# Altium project PCB_Control.V03.R00.PrjPcb (part 1 of 3)
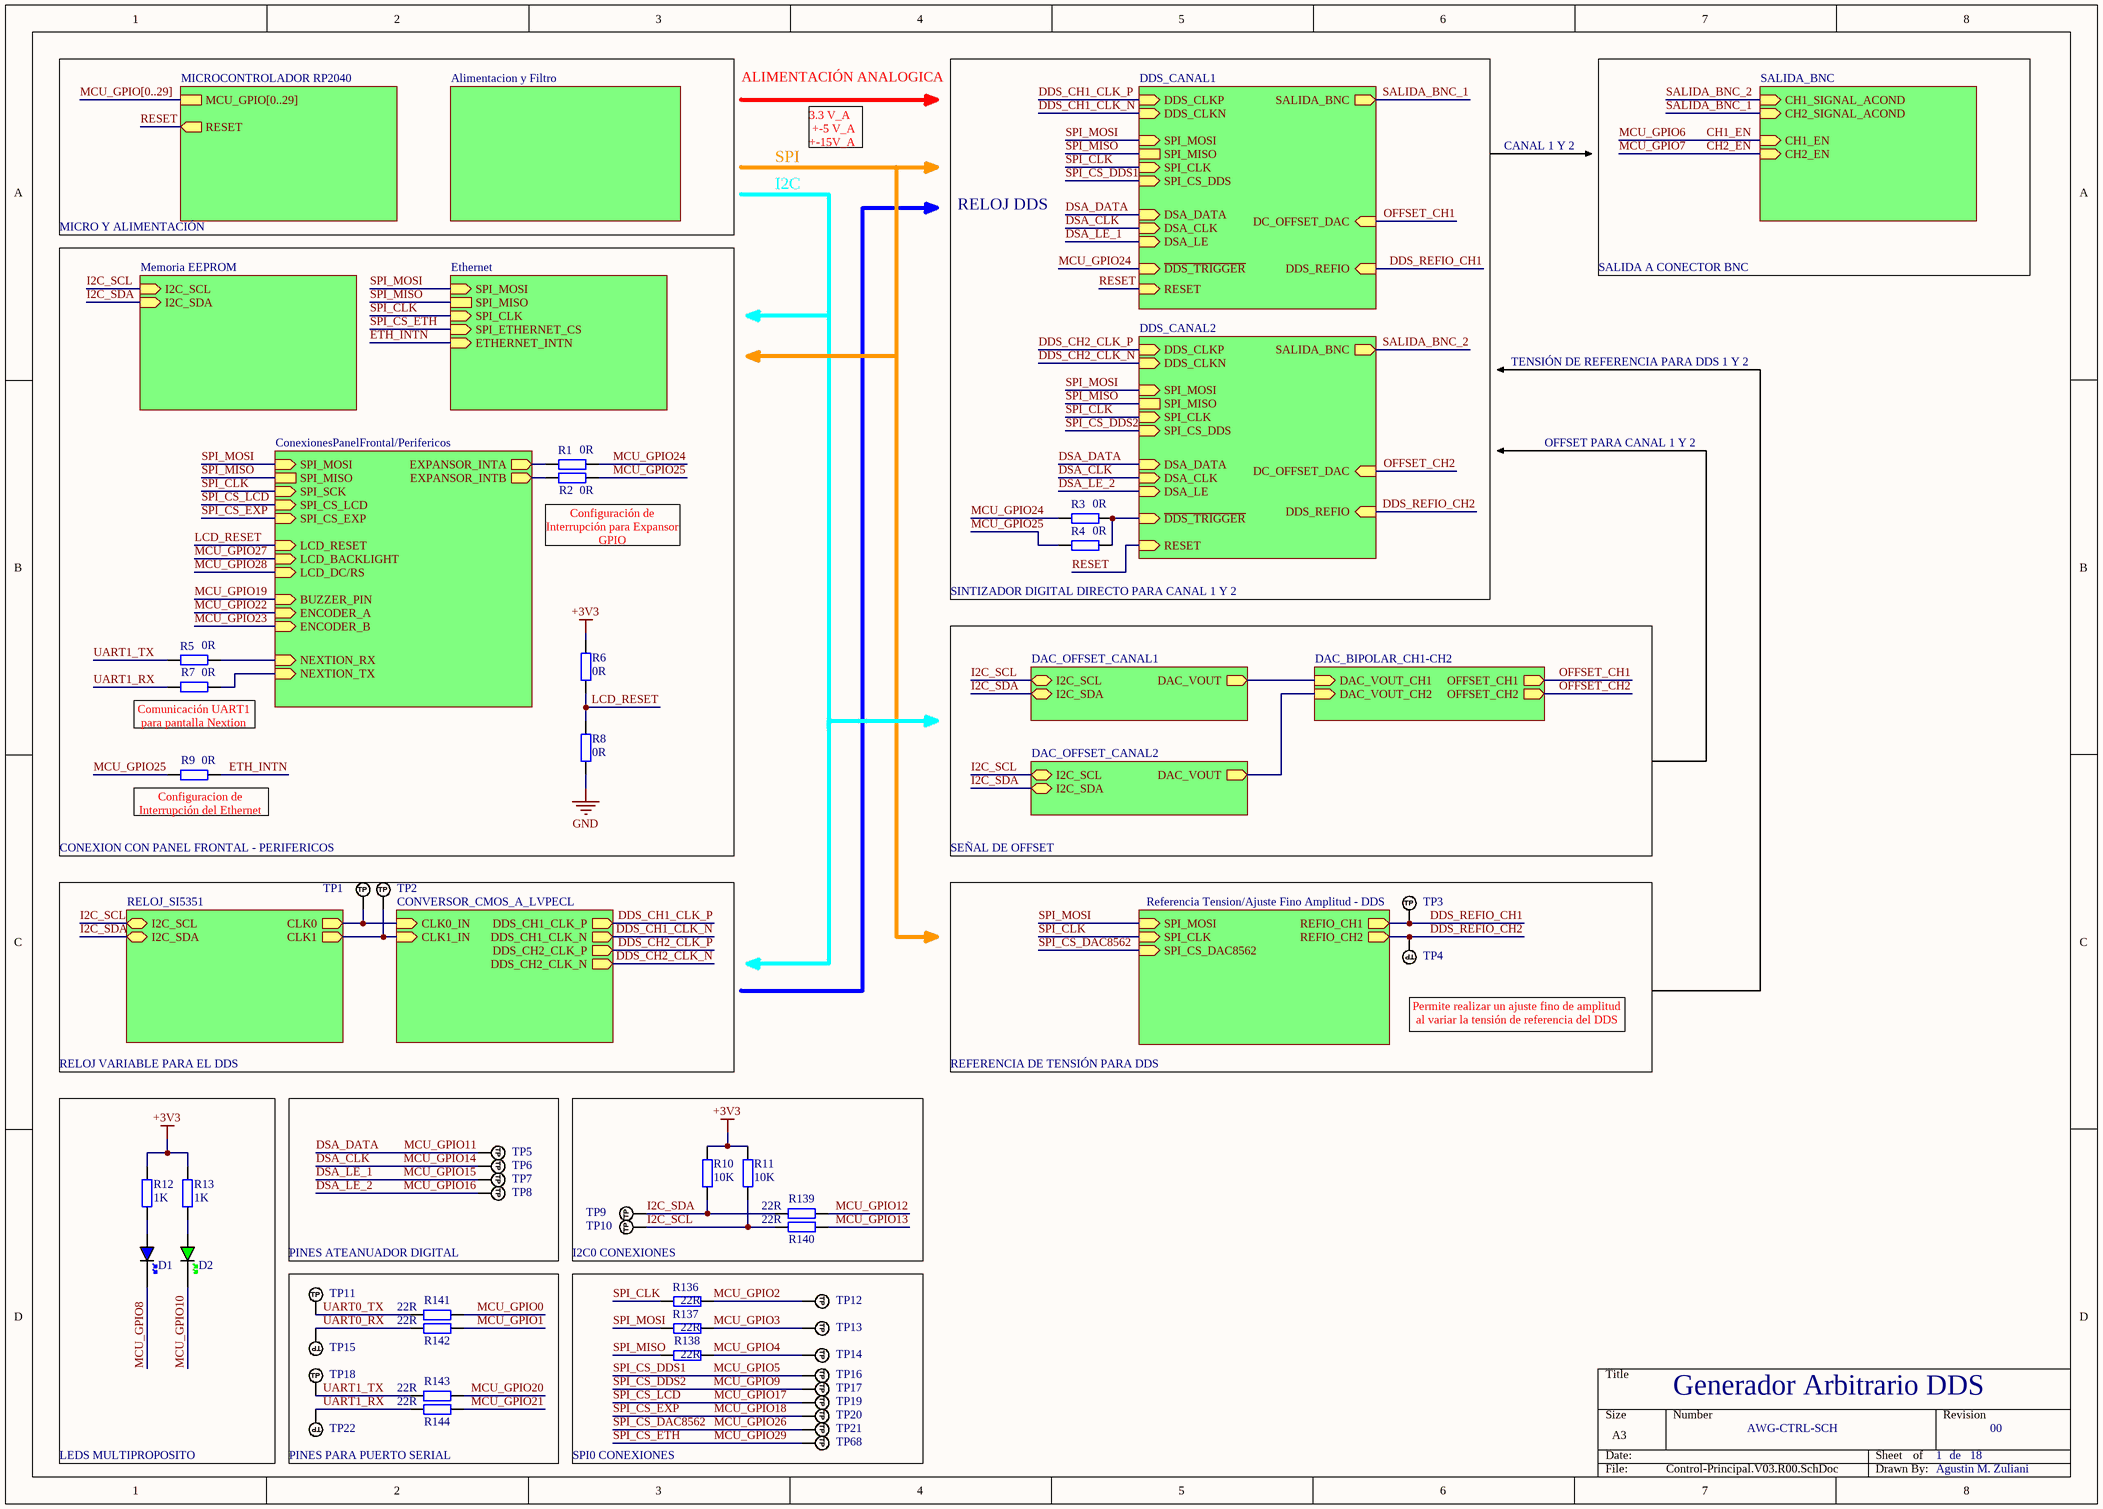
[diagram p0: Control-Principal.V03.R00.SchDoc]
DocumentNumber: AWG-CTRL-SCH; DrawnBy: Agustin M. Zuliani; Revision: 00
18 sheets, 539 parts. Net scope: hierarchical (ports join the sheet entries above them; power ports are global).
Board file: PCB_Control.V03.R00.PcbDoc
Sheets:
  Control-Principal.V03.R00.SchDoc
    MICROCONTROLADOR RP2040 = Microcontrolador.V03.R00.SchDoc
    RELOJ_SI5351 = SI5351.V03.R00.SchDoc
    DDS_CANAL1 = Canal-DDS.V03.R00.SchDoc
      DDS = Sintetizador-AD9102.V03.R00.SchDoc
      Conversor_Diff_A_Simple = DifferentialToSingleOutput.V03.R00.SchDoc
      Atenuador_Digital_Pasos = PE4312.V03.R00.SchDoc
      Offset = Offset.V03.R00.SchDoc
      Amplificador = Amplificador.V03.R00.SchDoc
    CONVERSOR_CMOS_A_LVPECL = SY55857L.V03.R00.SchDoc
    DAC_OFFSET_CANAL1 = MCP4725.V03.R00.SchDoc
    DAC_BIPOLAR_CH1-CH2 = OPA41971.V03.R00.SchDoc
    SALIDA_BNC = BNC-OUTPUT.V03.R00.SchDoc
    DDS_CANAL2 = Canal-DDS.V03.R00.SchDoc
      DDS = Sintetizador-AD9102.V03.R00.SchDoc
      Conversor_Diff_A_Simple = DifferentialToSingleOutput.V03.R00.SchDoc
      Atenuador_Digital_Pasos = PE4312.V03.R00.SchDoc
      Offset = Offset.V03.R00.SchDoc
      Amplificador = Amplificador.V03.R00.SchDoc
    DAC_OFFSET_CANAL2 = MCP4725.V03.R00.SchDoc
    Alimentacion y Filtro = Alimentacion.V03.R00.SchDoc
    ConexionesPanelFrontal/Perifericos = ConexionesPanelFrontal.V03.R00.SchDoc
    Referencia Tension/Ajuste Fino Amplitud - DDS = ReferenciaTensionDDS.V03.R00.SchDoc
    Memoria EEPROM = MemoriaEEPROM.V03.R00.SchDoc
    Ethernet = Ethernet.V03.R00.SchDoc

## Sheet Control-Principal.V03.R00.SchDoc: Generador Arbitrario DDS
size A3; SheetNumber: 1; SheetTotal: 18

### Parts
(Parts that share a designator on the sheet are numbered #1, #2 ... from top to bottom, then left to right.)
D1  BLUE  [LED_0805_BLUE]  (value not drawn)
D2  GREEN  [LED_0805_GREEN]  (value not drawn)
R1  0R  [RES_0805]
R2  0R  [RES_0805]
R3  0R  [RES_0805]
R4  0R  [RES_0805]
R5  0R  [RES_0805]
R6#1  0R  [RES_0805]
R7#1  0R  [RES_0805]
R8#1  0R  [RES_0805]
R9#1  0R  [RES_0805]
R10#1  10K  [RES_0805]
R11#1  10K  [RES_0805]
R12#1  1K  [RES_0805]
R13#1  1K  [RES_0805]
R136  22R  [RES_0805]
R137  22R  [RES_0805]
R138  22R  [RES_0805]
R139  22R  [RES_0805]
R140  22R  [RES_0805]
R141  22R  [RES_0805]
R142  22R  [RES_0805]
R143  22R  [RES_0805]
R144  22R  [RES_0805]
TP1  TP_NOBOM  [PAD_RND_1MM]  (value not drawn)  (no BOM)
TP2  TP_NOBOM  [PAD_RND_1MM]  (value not drawn)  (no BOM)
TP3  TP_NOBOM  [PAD_RND_1MM]  (value not drawn)  (no BOM)
TP4  TP_NOBOM  [PAD_RND_1MM]  (value not drawn)  (no BOM)
TP5  TP_NOBOM  [PAD_RND_1MM]  (value not drawn)  (no BOM)
TP6  TP_NOBOM  [PAD_RND_1MM]  (value not drawn)  (no BOM)
TP7  TP_NOBOM  [PAD_RND_1MM]  (value not drawn)  (no BOM)
TP8  TP_NOBOM  [PAD_RND_1MM]  (value not drawn)  (no BOM)
TP9  TP_NOBOM  [PAD_RND_1MM]  (value not drawn)  (no BOM)
TP10  TP_NOBOM  [PAD_RND_1MM]  (value not drawn)  (no BOM)
TP11  TP_NOBOM  [PAD_RND_1MM]  (value not drawn)  (no BOM)
TP12  TP_NOBOM  [PAD_RND_1MM]  (value not drawn)  (no BOM)
TP13  TP_NOBOM  [PAD_RND_1MM]  (value not drawn)  (no BOM)
TP14#1  TP_NOBOM  [PAD_RND_1MM]  (value not drawn)  (no BOM)
TP15#1  TP_NOBOM  [PAD_RND_1MM]  (value not drawn)  (no BOM)
TP16#1  TP_NOBOM  [PAD_RND_1MM]  (value not drawn)  (no BOM)
TP17#1  TP_NOBOM  [PAD_RND_1MM]  (value not drawn)  (no BOM)
TP18#1  TP_NOBOM  [PAD_RND_1MM]  (value not drawn)  (no BOM)
TP19#1  TP_NOBOM  [PAD_RND_1MM]  (value not drawn)  (no BOM)
TP20#1  TP_NOBOM  [PAD_RND_1MM]  (value not drawn)  (no BOM)
TP21#1  TP_NOBOM  [PAD_RND_1MM]  (value not drawn)  (no BOM)
TP22#1  TP_NOBOM  [PAD_RND_1MM]  (value not drawn)  (no BOM)
TP68#1  TP_NOBOM  [PAD_RND_1MM]  (value not drawn)  (no BOM)

### Blocks framed on the sheet
RELOJ DDS: R3 R4
RELOJ VARIABLE PARA EL DDS: TP1 TP2
REFERENCIA DE TENSIÓN PARA DDS: TP3 TP4
LEDS MULTIPROPOSITO: D1 D2 R12#1 R13#1
PINES ATEANUADOR DIGITAL: TP5-TP8
I2C0 CONEXIONES: R10#1 R11#1 R139 R140 TP9 TP10
PINES PARA PUERTO SERIAL: R141-R144 TP11 TP15#1 TP18#1 TP22#1
SPI0 CONEXIONES: R136-R138 TP12 TP13 TP14#1 TP16#1 TP17#1 TP19#1 TP20#1 TP21#1 TP68#1

### Sub-sheets
Alimentacion y Filtro = Alimentacion.V03.R00.SchDoc: no entries
ConexionesPanelFrontal/Perifericos = ConexionesPanelFrontal.V03.R00.SchDoc: SPI_MOSI (in), SPI_CS_LCD (in), SPI_SCK (in), LCD_DC/RS (in), LCD_RESET (in), LCD_BACKLIGHT (in), EXPANSOR_INTA (out), EXPANSOR_INTB (out), NEXTION_TX (in), NEXTION_RX (in), SPI_CS_EXP (in), BUZZER_PIN (in), ENCODER_A (in), ENCODER_B (in), SPI_MISO
CONVERSOR_CMOS_A_LVPECL = SY55857L.V03.R00.SchDoc: DDS_CH1_CLK_N (out), DDS_CH1_CLK_P (out), DDS_CH2_CLK_P (out), DDS_CH2_CLK_N (out), CLK0_IN (in), CLK1_IN (in)
DAC_BIPOLAR_CH1-CH2 = OPA41971.V03.R00.SchDoc: OFFSET_CH1 (out), DAC_VOUT_CH1 (in), DAC_VOUT_CH2 (in), OFFSET_CH2 (out)
DAC_OFFSET_CANAL1 = MCP4725.V03.R00.SchDoc: DAC_VOUT (out), I2C_SCL (bidir), I2C_SDA (bidir)
DAC_OFFSET_CANAL2 = MCP4725.V03.R00.SchDoc: DAC_VOUT (out), I2C_SCL (bidir), I2C_SDA (bidir)
DDS_CANAL1 = Canal-DDS.V03.R00.SchDoc: DDS_CLKP (in), DDS_CLKN (in), SPI_MOSI (in), SPI_MISO, SPI_CLK (in), SPI_CS_DDS (in), DSA_DATA (in), DSA_CLK (in), DSA_LE (in), DC_OFFSET_DAC (in), SALIDA_BNC (out), ~{DDS_TRIGGER} (in), DDS_REFIO (in), RESET (in)
DDS_CANAL2 = Canal-DDS.V03.R00.SchDoc: DDS_CLKP (in), DDS_CLKN (in), SPI_MOSI (in), SPI_MISO, SPI_CLK (in), SPI_CS_DDS (in), DSA_DATA (in), DSA_CLK (in), DSA_LE (in), DC_OFFSET_DAC (in), SALIDA_BNC (out), ~{DDS_TRIGGER} (in), DDS_REFIO (in), RESET (in)
Ethernet = Ethernet.V03.R00.SchDoc: SPI_MOSI (in), SPI_MISO, SPI_CLK (in), SPI_ETHERNET_CS (in), ETHERNET_INTN (in)
Memoria EEPROM = MemoriaEEPROM.V03.R00.SchDoc: I2C_SCL (in), I2C_SDA (in)
MICROCONTROLADOR RP2040 = Microcontrolador.V03.R00.SchDoc: MCU_GPIO[0..29], RESET (out)
Referencia Tension/Ajuste Fino Amplitud - DDS = ReferenciaTensionDDS.V03.R00.SchDoc: REFIO_CH1 (out), REFIO_CH2 (out), SPI_MOSI (in), SPI_CLK (in), SPI_CS_DAC8562 (in)
RELOJ_SI5351 = SI5351.V03.R00.SchDoc: I2C_SCL (bidir), I2C_SDA (bidir), CLK0 (out), CLK1 (out)
SALIDA_BNC = BNC-OUTPUT.V03.R00.SchDoc: CH1_EN (in), CH1_SIGNAL_ACOND (in), CH2_EN (in), CH2_SIGNAL_ACOND (in)

### Nets
+3V3: R6#1.1 R10#1.2 R11#1.2 R12#1.2 R13#1.2
GND: R8#1.1
DDS_CH1_CLK_N: sheet DDS_CANAL1/DDS_CLKN, sheet CONVERSOR_CMOS_A_LVPECL/DDS_CH1_CLK_N  [project net AD9102_CLK_N]
DDS_CH1_CLK_P: sheet DDS_CANAL1/DDS_CLKP, sheet CONVERSOR_CMOS_A_LVPECL/DDS_CH1_CLK_P  [project net AD9102_CLK_P]
DDS_CH2_CLK_N: sheet CONVERSOR_CMOS_A_LVPECL/DDS_CH2_CLK_N, sheet DDS_CANAL2/DDS_CLKN  [project net AD9102_CLK_N]
DDS_CH2_CLK_P: sheet CONVERSOR_CMOS_A_LVPECL/DDS_CH2_CLK_P, sheet DDS_CANAL2/DDS_CLKP  [project net AD9102_CLK_P]
DDS_REFIO_CH1: TP3.1(TP) ; sheet DDS_CANAL1/DDS_REFIO, sheet Referencia Tension/Ajuste Fino Amplitud - DDS/REFIO_CH1
DDS_REFIO_CH2: TP4.1(TP) ; sheet DDS_CANAL2/DDS_REFIO, sheet Referencia Tension/Ajuste Fino Amplitud - DDS/REFIO_CH2
DSA_CLK: TP6.1(TP) ; sheet DDS_CANAL1/DSA_CLK, sheet DDS_CANAL2/DSA_CLK  [also labelled MCU_GPIO14]
DSA_DATA: TP5.1(TP) ; sheet DDS_CANAL1/DSA_DATA, sheet DDS_CANAL2/DSA_DATA  [also labelled MCU_GPIO11]
DSA_LE_1: TP7.1(TP) ; sheet DDS_CANAL1/DSA_LE  [also labelled MCU_GPIO15]
DSA_LE_2: TP8.1(TP) ; sheet DDS_CANAL2/DSA_LE  [also labelled MCU_GPIO16]
ETH_INTN: R9#1.2 ; sheet Ethernet/ETHERNET_INTN
I2C_SCL: R11#1.1 R140.1 TP10.1(TP) ; sheet RELOJ_SI5351/I2C_SCL, sheet DAC_OFFSET_CANAL1/I2C_SCL, sheet DAC_OFFSET_CANAL2/I2C_SCL, sheet Memoria EEPROM/I2C_SCL
I2C_SDA: R10#1.1 R139.1 TP9.1(TP) ; sheet RELOJ_SI5351/I2C_SDA, sheet DAC_OFFSET_CANAL1/I2C_SDA, sheet DAC_OFFSET_CANAL2/I2C_SDA, sheet Memoria EEPROM/I2C_SDA
INTA: R1.1 ; sheet ConexionesPanelFrontal/Perifericos/EXPANSOR_INTA
INTB: R2.1 ; sheet ConexionesPanelFrontal/Perifericos/EXPANSOR_INTB
LCD_RESET: R6#1.2 R8#1.2 ; sheet ConexionesPanelFrontal/Perifericos/LCD_RESET
MCP4725_VOUT: sheet DAC_OFFSET_CANAL1/DAC_VOUT, sheet DAC_BIPOLAR_CH1-CH2/DAC_VOUT_CH1
MCP4725_VOUT: sheet DAC_BIPOLAR_CH1-CH2/DAC_VOUT_CH2, sheet DAC_OFFSET_CANAL2/DAC_VOUT  [a separate net that carries the same name]
MCU_GPIO0: R141.2
MCU_GPIO1: R142.2
MCU_GPIO2: R136.2 TP12.1(TP)
MCU_GPIO3: R137.2 TP13.1(TP)
MCU_GPIO4: R138.2 TP14#1.1(TP)
MCU_GPIO5: TP16#1.1(TP) ; sheet DDS_CANAL1/SPI_CS_DDS  [also labelled SPI_CS_DDS1]
MCU_GPIO8: D1.K
MCU_GPIO9: TP17#1.1(TP) ; sheet DDS_CANAL2/SPI_CS_DDS  [also labelled SPI_CS_DDS2]
MCU_GPIO10: D2.K
MCU_GPIO12: R139.2
MCU_GPIO13: R140.2
MCU_GPIO17: TP19#1.1(TP) ; sheet ConexionesPanelFrontal/Perifericos/SPI_CS_LCD  [also labelled SPI_CS_LCD]
MCU_GPIO18: TP20#1.1(TP) ; sheet ConexionesPanelFrontal/Perifericos/SPI_CS_EXP  [also labelled SPI_CS_EXP]
MCU_GPIO20: R143.2
MCU_GPIO21: R144.2
MCU_GPIO24: R1.2 R3.1 ; sheet DDS_CANAL1/~{DDS_TRIGGER}
MCU_GPIO25: R2.2 R4.1 R9#1.1
MCU_GPIO26: TP21#1.1(TP) ; sheet Referencia Tension/Ajuste Fino Amplitud - DDS/SPI_CS_DAC8562  [also labelled SPI_CS_DAC8562]
MCU_GPIO29: TP68#1.1(TP) ; sheet Ethernet/SPI_ETHERNET_CS  [also labelled SPI_CS_ETH]
NEXTION_RX: R5.2 ; sheet ConexionesPanelFrontal/Perifericos/NEXTION_RX
NEXTION_TX: R7#1.2 ; sheet ConexionesPanelFrontal/Perifericos/NEXTION_TX
OFFSET_CH1: sheet DDS_CANAL1/DC_OFFSET_DAC, sheet DAC_BIPOLAR_CH1-CH2/OFFSET_CH1  [project net DAC_DC_VIN]
OFFSET_CH2: sheet DAC_BIPOLAR_CH1-CH2/OFFSET_CH2, sheet DDS_CANAL2/DC_OFFSET_DAC  [project net DAC_DC_VIN]
RESET: sheet MICROCONTROLADOR RP2040/RESET, sheet DDS_CANAL1/RESET, sheet DDS_CANAL2/RESET
SALIDA_BNC_1: sheet DDS_CANAL1/SALIDA_BNC, sheet SALIDA_BNC/CH2_SIGNAL_ACOND  [project net AMPL_VOUT]
SALIDA_BNC_2: sheet SALIDA_BNC/CH1_SIGNAL_ACOND, sheet DDS_CANAL2/SALIDA_BNC  [project net AMPL_VOUT]
SI5351_CLK0: TP1.1(TP) ; sheet RELOJ_SI5351/CLK0, sheet CONVERSOR_CMOS_A_LVPECL/CLK0_IN
SI5351_CLK1: TP2.1(TP) ; sheet RELOJ_SI5351/CLK1, sheet CONVERSOR_CMOS_A_LVPECL/CLK1_IN
SPI_CLK: R136.1 ; sheet DDS_CANAL1/SPI_CLK, sheet DDS_CANAL2/SPI_CLK, sheet ConexionesPanelFrontal/Perifericos/SPI_SCK, sheet Referencia Tension/Ajuste Fino Amplitud - DDS/SPI_CLK, sheet Ethernet/SPI_CLK
SPI_MISO: R138.1 ; sheet DDS_CANAL1/SPI_MISO, sheet DDS_CANAL2/SPI_MISO, sheet ConexionesPanelFrontal/Perifericos/SPI_MISO, sheet Ethernet/SPI_MISO
SPI_MOSI: R137.1 ; sheet DDS_CANAL1/SPI_MOSI, sheet DDS_CANAL2/SPI_MOSI, sheet ConexionesPanelFrontal/Perifericos/SPI_MOSI, sheet Referencia Tension/Ajuste Fino Amplitud - DDS/SPI_MOSI, sheet Ethernet/SPI_MOSI
UART0_RX: R142.1 TP15#1.1(TP)
UART0_TX: R141.1 TP11.1(TP)
UART1_RX: R7#1.1 R144.1 TP22#1.1(TP)
UART1_TX: R5.1 R143.1 TP18#1.1(TP)
NetB17_32: R3.2 R4.2 ; sheet DDS_CANAL2/~{DDS_TRIGGER}
NetD1_A: D1.A R12#1.1
NetD2_A: D2.A R13#1.1

### Buses and harness runs
bus MCU_GPIO[0..29] = sheet MICROCONTROLADOR RP2040/MCU_GPIO[0..29]

### Notes on the sheet
- ALIMENTACIÓN ANALOGICA
- SPI
- 3.3 V_A
  +-5 V_A
  +-15V_A
- CANAL 1 Y 2
- MICRO Y ALIMENTACIÓN
- I2C
- SALIDA A CONECTOR BNC
- TENSIÓN DE REFERENCIA PARA DDS 1 Y 2
- OFFSET PARA CANAL 1 Y 2
- Configuración de Interrupción para Expansor GPIO
- (near R4) SINTIZADOR DIGITAL DIRECTO PARA CANAL 1 Y 2
- (near R7#1) Comunicación UART1 para pantalla Nextion
- CONEXION CON PANEL FRONTAL - PERIFERICOS
- (near R9#1) Configuracion de Interrupción del Ethernet
- SEÑAL DE OFFSET
- (near TP4) Permite realizar un ajuste fino de amplitud al variar la tensión de referencia del DDS
- de

### Library data of the parts
D1 = LED_0805_BLUE: LED 0805 BLUE SMD; Manufacturer: *; Manufacturer Part Number: *; Distributor Link: *; LCSC: *
D2 = LED_0805_GREEN: LED 0805 GREEN SMD; Manufacturer: *; Manufacturer Part Number: *; Distributor Link: *; LCSC: *
R1-R5 R6#1 R7#1 R8#1 R9#1 R10#1 R11#1 R12#1 R13#1 R136-R144 = RES_0805: Resistor SMD 0805; Manufacturer: *; Manufacturer Part Number: *; Distributor Link: *; LCSC: *
TP1-TP13 TP14#1 TP15#1 TP16#1 TP17#1 TP18#1 TP19#1 TP20#1 TP21#1 TP22#1 TP68#1 = TEST_POINT_RND_1MM: Test Point Round 1mm (NO BOM)

## Sheet Microcontrolador.V03.R00.SchDoc: Microcontrolador RP2040
size A3; SheetNumber: 2; SheetTotal: 18
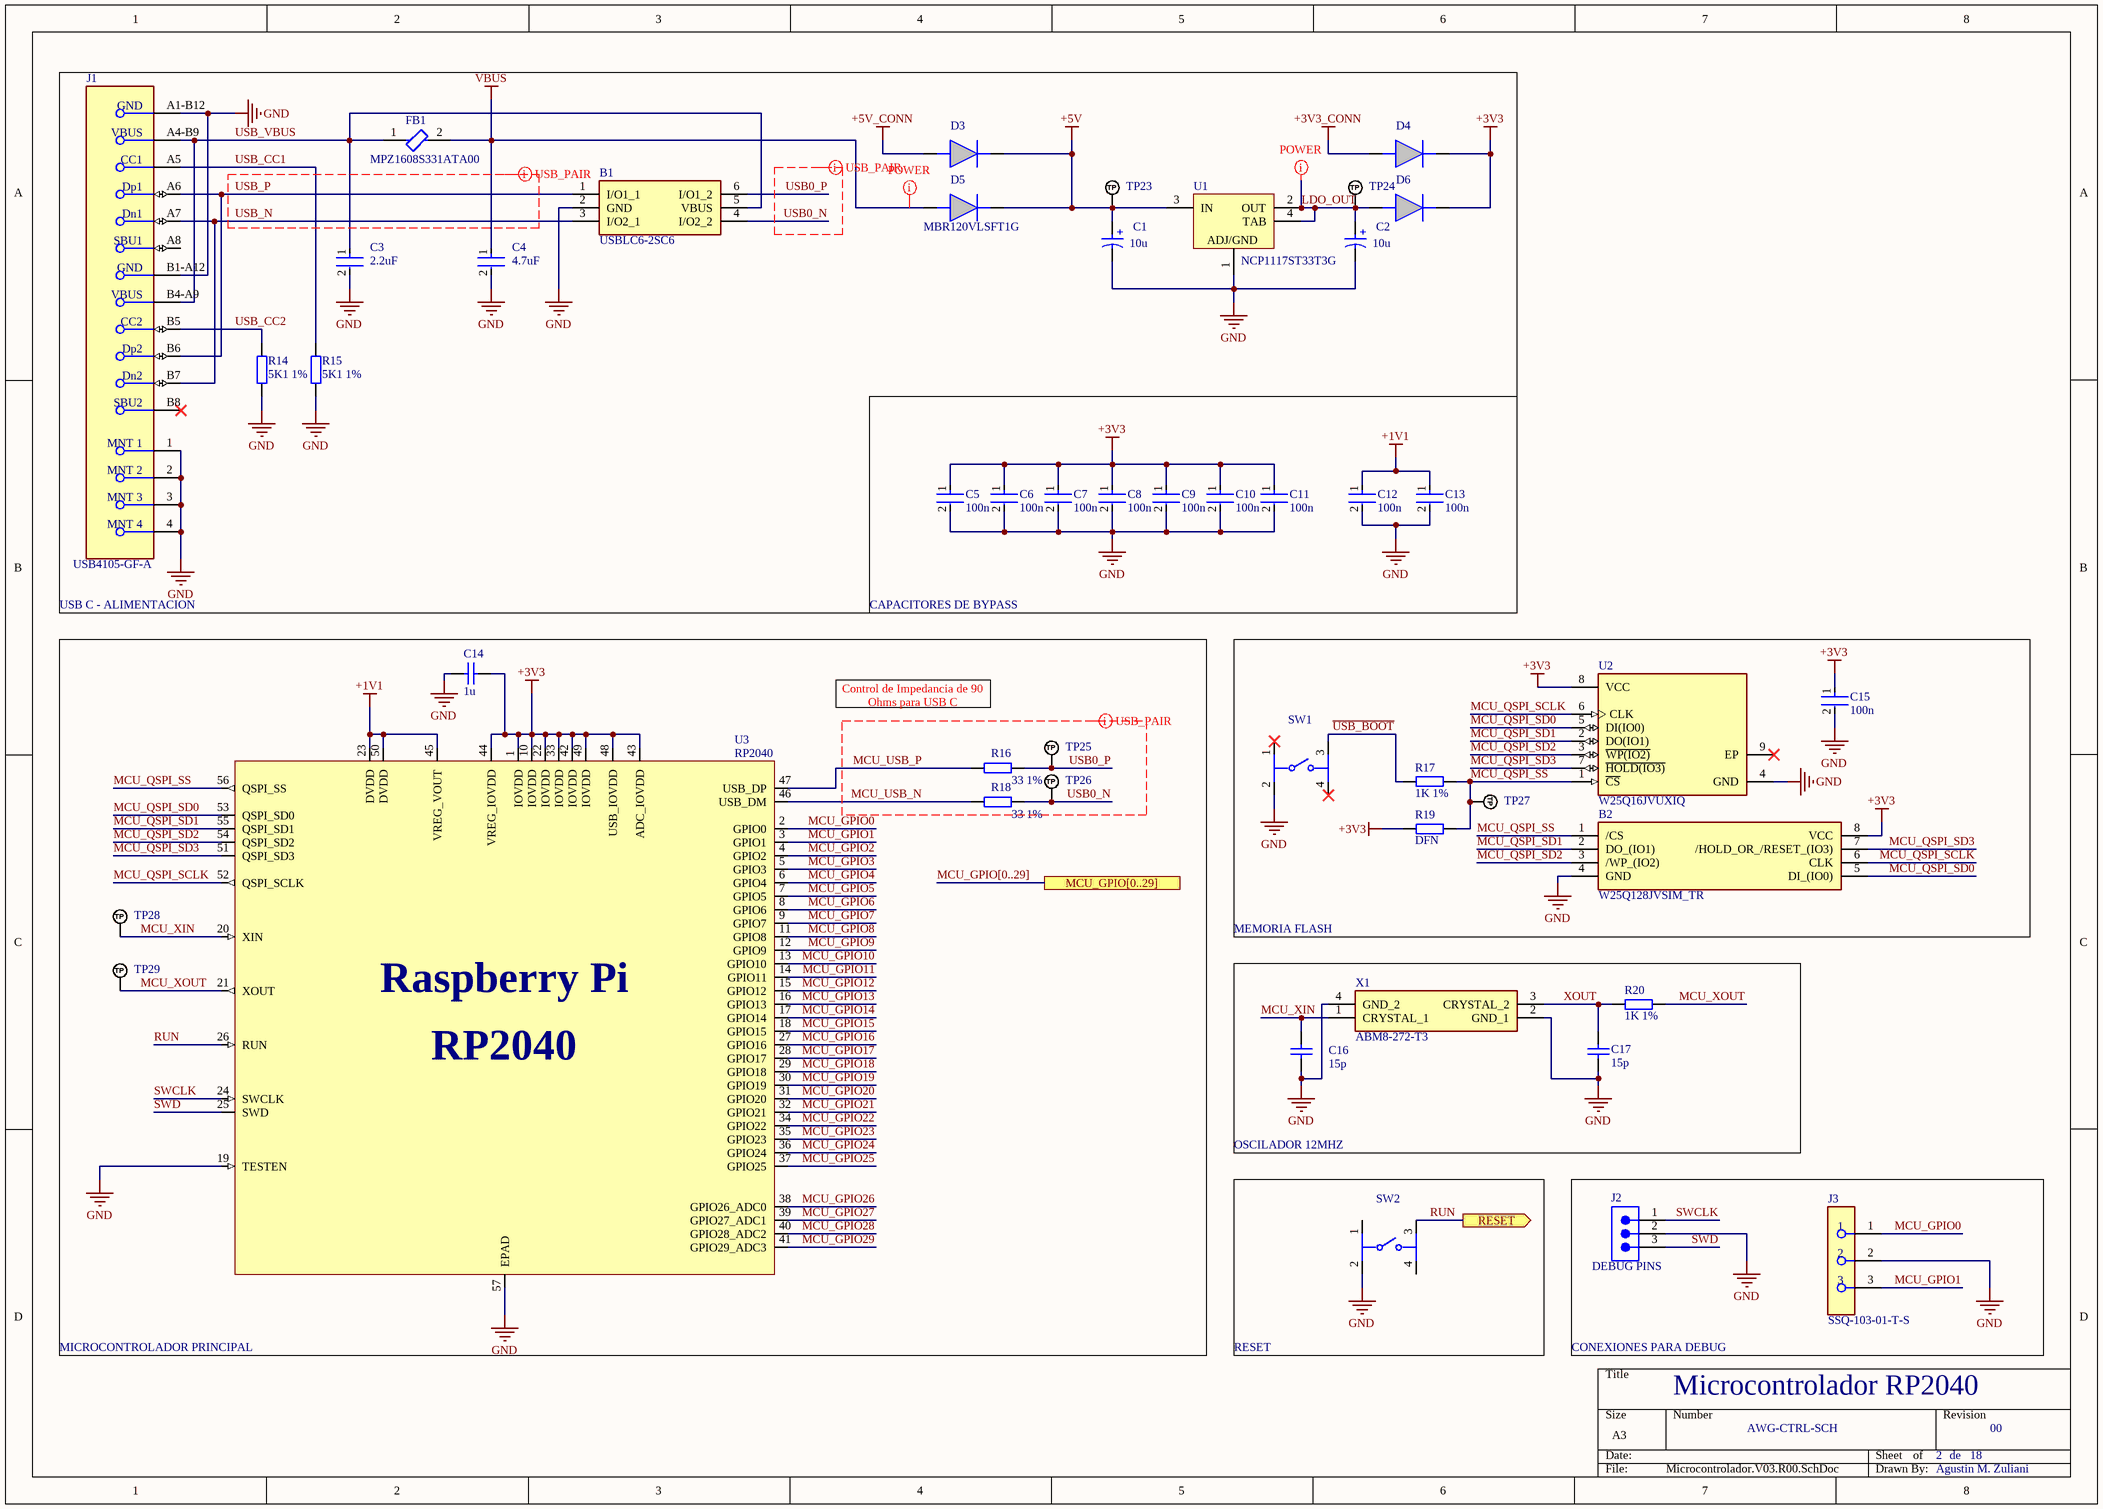
[diagram p1: Microcontrolador.V03.R00.SchDoc]

### Parts
(Parts that share a designator on the sheet are numbered #1, #2 ... from top to bottom, then left to right.)
B1  USBLC6-2SC6  [SOT95P280X145-6N]
B2#1  W25Q128JVSIM_TR  [SOIC127P790X216-8N]
C1  10u  [WCAP-ASLI_D6.3H7.7]
C2  10u  [WCAP-ASLI_D6.3H7.7]
C3  2.2uF  [FP-CC0603-DA-MFG]
C4  4.7uF  [FP-GRM21B-0_15-IPC_A]
C5  100n  [FP-CC0805-EB-MFG]
C6  100n  [FP-CC0805-EB-MFG]
C7  100n  [FP-CC0805-EB-MFG]
C8  100n  [FP-CC0805-EB-MFG]
C9  100n  [FP-CC0805-EB-MFG]
C10  100n  [FP-CC0805-EB-MFG]
C11  100n  [FP-CC0805-EB-MFG]
C12  100n  [FP-CC0805-EB-MFG]
C13  100n  [FP-CC0805-EB-MFG]
C14  1u  [CAPC2013X140X50NL20T25]
C15  100n  [FP-CC0805-EB-MFG]
C16  15p  [CAPC2013X94X50NL20T25]
C17  15p  [CAPC2013X94X50NL20T25]
D3  MBR120VLSFT1G  [SODFL3616X98N]  (value not drawn)
D4  MBR120VLSFT1G  [SODFL3616X98N]  (value not drawn)
D5  MBR120VLSFT1G  [SODFL3616X98N]
D6  MBR120VLSFT1G  [SODFL3616X98N]  (value not drawn)
FB1  MPZ1608S331ATA00  [FP-MPZ1608-0_8-IPC_C]
J1  USB4105-GF-A  [FP-USB4105-GF-A-MFG]
J2  DEBUG PINS  [SMTC-MTSW-103-08-X-S-229-RA]
J3  SSQ-103-01-T-S  [FP-SSQ-103-01-T-S-MFG]
R14#1  5K1 1%  [RES_0805]
R15#1  5K1 1%  [RES_0805]
R16#1  33 1%  [RES_0805]
R17#1  1K 1%  [RES_0805]
R18  33 1%  [RES_0805]
R19  DFN  [RES_0805]
R20  1K 1%  [RES_0805]
SW1  BOOT  [FP-2-1977223-2-MFG]  (value not drawn)
SW2  RESET  [FP-2-1977223-2-MFG]  (value not drawn)
TP23#1  TP_NOBOM  [PAD_RND_1MM]  (value not drawn)  (no BOM)
TP24  TP_NOBOM  [PAD_RND_1MM]  (value not drawn)  (no BOM)
TP25  TP_NOBOM  [PAD_RND_1MM]  (value not drawn)  (no BOM)
TP26  TP_NOBOM  [PAD_RND_1MM]  (value not drawn)  (no BOM)
TP27  TP_NOBOM  [PAD_RND_1MM]  (value not drawn)  (no BOM)
TP28  TP_NOBOM  [PAD_RND_1MM]  (value not drawn)  (no BOM)
TP29  TP_NOBOM  [PAD_RND_1MM]  (value not drawn)  (no BOM)
U1#1  NCP1117ST33T3G  [ONSC-SOT-223-4-318H-01_A_V]
U2#1  W25Q16JVUXIQ  [FP-UX-MFG]
U3#1  RP2040  [QFN-56-EP]
X1  ABM8-272-T3  [ABM8272T3]

### Blocks framed on the sheet
USB C - ALIMENTACION: B1 C1-C4 D3-D6 FB1 J1 R14#1 R15#1 TP23#1 TP24 U1#1
CAPACITORES DE BYPASS: C5-C13
MICROCONTROLADOR PRINCIPAL: C14 R16#1 R18 TP25 TP26 TP28 TP29 U3#1
MEMORIA FLASH: B2#1 C15 R17#1 R19 SW1 TP27 U2#1
OSCILADOR 12MHZ: C16 C17 R20 X1
RESET: SW2
CONEXIONES PARA DEBUG: J2 J3

### Ports
MCU_GPIO[0..29], RESET (out)

### Nets
+1V1: C12.1 C13.1 U3#1.23(DVDD) U3#1.45(VREG_VOUT) U3#1.50(DVDD)
+3V3: B2#1.8(VCC) C5.1 C6.1 C7.1 C8.1 C9.1 C10.1 C11.1 C14.2 C15.1 D4.1(K) D6.1(K) R19.1 U2#1.8(VCC) U3#1.1(IOVDD) U3#1.10(IOVDD) U3#1.22(IOVDD) U3#1.33(IOVDD) U3#1.42(IOVDD) U3#1.43(ADC_IOVDD) U3#1.44(VREG_IOVDD) U3#1.48(USB_IOVDD) U3#1.49(IOVDD)
+3V3_CONN: D4.2(A)
+5V: C1.1(P) D3.1(K) D5.1(K) TP23#1.1(TP) U1#1.3(IN)
+5V_CONN: D3.2(A)
GND: B1.2(GND) B2#1.4(GND) C1.2(N) C2.2(N) C3.2 C4.2 C5.2 C6.2 C7.2 C8.2 C9.2 C10.2 C11.2 C12.2 C13.2 C14.1 C15.2 C16.1 C17.1 J1.1(MNT_1) J1.2(MNT_2) J1.3(MNT_3) J1.4(MNT_4) J1.A1-B12(GND) J1.B1-A12(GND) J2.2 J3.2 R14#1.1 R15#1.1 SW1.2 SW2.2 U1#1.1(ADJ/GND) U2#1.4(GND) U3#1.19(TESTEN) U3#1.57(EPAD) X1.2(GND_1) X1.4(GND_2)
VBUS: C4.1 D5.2(A) FB1.2
~{USB_BOOT}: R17#1.1 SW1.3
LDO_OUT: C2.1(P) D6.2(A) TP24.1(TP) U1#1.2(OUT) U1#1.4(TAB)
MCU_GPIO0: J3.1 U3#1.2(GPIO0)
MCU_GPIO1: J3.3 U3#1.3(GPIO1)
MCU_GPIO2: U3#1.4(GPIO2)
MCU_GPIO3: U3#1.5(GPIO3)
MCU_GPIO4: U3#1.6(GPIO4)
MCU_GPIO5: U3#1.7(GPIO5)
MCU_GPIO6: U3#1.8(GPIO6)  [project net CH1_EN]
MCU_GPIO7: U3#1.9(GPIO7)  [project net CH2_EN]
MCU_GPIO8: U3#1.11(GPIO8)
MCU_GPIO9: U3#1.12(GPIO9)
MCU_GPIO10: U3#1.13(GPIO10)
MCU_GPIO11: U3#1.14(GPIO11)  [project net DSA_DATA]
MCU_GPIO12: U3#1.15(GPIO12)
MCU_GPIO13: U3#1.16(GPIO13)
MCU_GPIO14: U3#1.17(GPIO14)  [project net DSA_CLK]
MCU_GPIO15: U3#1.18(GPIO15)  [project net DSA_LE_1]
MCU_GPIO16: U3#1.27(GPIO16)  [project net DSA_LE_2]
MCU_GPIO17: U3#1.28(GPIO17)
MCU_GPIO18: U3#1.29(GPIO18)
MCU_GPIO19: U3#1.30(GPIO19)  [project net BUZZER]
MCU_GPIO20: U3#1.31(GPIO20)
MCU_GPIO21: U3#1.32(GPIO21)
MCU_GPIO22: U3#1.34(GPIO22)  [project net ENCODER_A]
MCU_GPIO23: U3#1.35(GPIO23)  [project net ENCODER_B]
MCU_GPIO24: U3#1.36(GPIO24)
MCU_GPIO25: U3#1.37(GPIO25)
MCU_GPIO26: U3#1.38(GPIO26_ADC0)
MCU_GPIO27: U3#1.39(GPIO27_ADC1)
MCU_GPIO28: U3#1.40(GPIO28_ADC2)
MCU_GPIO29: U3#1.41(GPIO29_ADC3)
MCU_QSPI_SCLK: B2#1.6(CLK) U2#1.6(CLK) U3#1.52(QSPI_SCLK)
MCU_QSPI_SD0: B2#1.5(DI_(IO0)) U2#1.5(DI(IO0)) U3#1.53(QSPI_SD0)
MCU_QSPI_SD1: B2#1.2(DO_(IO1)) U2#1.2(DO(IO1)) U3#1.55(QSPI_SD1)
MCU_QSPI_SD2: B2#1.3(/WP_(IO2)) U2#1.3(~{WP(IO2)}) U3#1.54(QSPI_SD2)
MCU_QSPI_SD3: B2#1.7(/HOLD_OR_/RESET_(IO3)) U2#1.7(~{HOLD(IO3)}) U3#1.51(QSPI_SD3)
MCU_QSPI_SS: B2#1.1(/CS) R17#1.2 R19.2 TP27.1(TP) U2#1.1(~{CS}) U3#1.56(QSPI_SS)
MCU_USB_N: R18.1 U3#1.46(USB_DM)
MCU_USB_P: R16#1.1 U3#1.47(USB_DP)
MCU_XIN: C16.2 TP28.1(TP) U3#1.20(XIN) X1.1(CRYSTAL_1)
MCU_XOUT: R20.2 TP29.1(TP) U3#1.21(XOUT)
RUN: SW2.3 U3#1.26(RUN) ; port RESET  [project net RESET]
SWCLK: J2.1 U3#1.24(SWCLK)
SWD: J2.3 U3#1.25(SWD)
USB0_N: B1.4(I/O2_2) R18.2 TP26.1(TP)
USB0_P: B1.6(I/O1_2) R16#1.2 TP25.1(TP)
USB_CC1: J1.A5(CC1) R15#1.2
USB_CC2: J1.B5(CC2) R14#1.2
USB_N: B1.3(I/O2_1) J1.A7(Dn1) J1.B7(Dn2)
USB_P: B1.1(I/O1_1) J1.A6(Dp1) J1.B6(Dp2)
USB_VBUS: B1.5(VBUS) C3.1 FB1.1 J1.A4-B9(VBUS) J1.B4-A9(VBUS)
XOUT: C17.2 R20.1 X1.3(CRYSTAL_2)

Not connected (* = marked no-connect by the designer): J1 A8(SBU1) B8(SBU2)*; SW1 1* 4*; SW2 1 4; U2#1 9(EP)*

### Buses and harness runs
bus MCU_GPIO[0..29] = port MCU_GPIO[0..29]

### Layout directives
differential pair; differential pair class USB; rule Differential Pairs Routing [Pref Gap = 0.127mm    Min Gap  = 0.127mm    Max Gap  = 0.2mmPref Width = 0.15mm    Min Width  = 0.116mm    Max Width  = 0.16mm]; rule Matched Net Lengths [Tolerance = 0.25mm]; net class USB: MCU_USB_N, MCU_USB_P, USB0_N, USB0_P, USB_N, USB_P
net class POWER; rule Width Constraint [Pref Width = 0.5mm    Min Width = 0.2mm    Max Width = 1mm]; rule Routing Via Style [Pref Size = 1.27mm    Pref Hole Size = 0.711mm]; rule Clearance Constraint [Clearance = 0.2mm]; rule Polygon Connect Style [Style - Direct Connect]: LDO_OUT, VBUS

### Notes on the sheet
- Control de Impedancia de 90 Ohms para USB C
- de
- (in symbol CMP-03913-89507488-2) +

### Library data of the parts
B1 = USBLC6-2SC6: TVS Diode Array Uni-Directional USBLC6-2SC6 17V, SOT-23 6-Pin; Manufacturer_Name: STMicroelectronics; Geometry.Height: 1.45mm; Mouser Part Number: 511-USBLC6-2SC6; Mouser Price/Stock: https://www.mouser.co.uk/ProductDetail/STMicroelectronics/USBLC6-2SC6?qs=po45yt2pPpu%2FhNIlwQdTlg%3D%3D; Manufacturer_Part_Number: USBLC6-2SC6; Datasheet Link: https://www.st.com/resource/en/datasheet/usblc6-2.pdf
B2#1 = W25Q128JVSIM_TR: 3V 128M-BIT SERIAL FLASH MEMORY WITH DUAL/QUAD SPI & QPI & DTR; Manufacturer_Name: Winbond; Manufacturer_Part_Number: W25Q128JVSIM TR; Geometry.Height: 2.16mm; Mouser Part Number: 454-W25Q128JVSIMTR; Mouser Price/Stock: https://www.mouser.co.uk/ProductDetail/Winbond/W25Q128JVSIM-TR?qs=qSfuJ%252Bfl%2Fd6ji9IuruL6Zg%3D%3D; Datasheet Link: http://www.winbond.com/resource-files/w25q128jv%20dtr%20revb%2011042016.pdf
C1 C2 = CMP-03913-89507488-2: WCAP-ASLI Radial Can - SMD aluminum electrolytic capacitor 0.248Dia 6.30mm ±20% 10muF 80V; Capacitance: 10µF; Leakage Current: 8µA; Insulation Resistance: 10MΩ; Ripple Current: 35mA; Impedance: 2.661Ω; Max Operating Temperature: 105°C; RoHS: Compliant; Voltage Rating: 80V; Width: 6.6mm; Min Operating Temperature: -55°C; Voltage Rating (DC): 80V; Packaging: Cut Tape; Diameter: 6.3mm; Height: 7.7mm; Length: 7.7mm
C3 = CMP-03422-000187-1: CC0603 2.2 uF X5R 10.00% 16 V; Manufacturer: YAGEO; Manufacturer Part Number: CC0603KPX5R7BB225; Voltage Rating: 16 V; Material: Ceramic; Tolerance: 0.1; Temperature Coefficient: 15%; ComponentLink2Description: Datasheet; Device Class L3: Ceramic Capacitors; Temperature Characteristic: X5R; Package: CC0603-DA; Automotive: No; Device Class L1: Passive Components; ComponentLink2URL: http://www.yageo.com/documents/recent/UPY-GPHC_X7R_6.3V-to-50V_18.pdf; Value: 2.2 uF; RoHS: TRUE; Height: 0.9mm; Temperature Range High: +125°C; Footprint Url: http://www.yageo.com/exep/pages/download/literatures/UPY-C_GEN_24.pdf; Lead Free: Yes; Temperature Range Low: -55°C; Capacitance: 2.2 uF; Octopart: https://octopart.com/cc0603kpx5r7bb225-yageo-91091799; Device Class L2: Capacitors; Voltage: 16 V; Temperature: -55°C to +125°C; Category: Cap
C4 = CMP-06035-033280-1: Chip Multilayer Ceramic Capacitors for General Purpose, 0805, 4.7uF, X6S, 22%, 20%, 35V; Length: 2mm; Dielectric: X6S; Width: 1.25mm; Capacitance: 4.7uF; Case/Package: 0805; Tolerance: 20%; Voltage Rating (DC): 35V; Thickness: 1.25mm
C5-C13 C15 = CMP-00621-107850848-1: CC0805KKX7RYBB104 Capacitor Ceramic 0.01uF 250V X7R 10% 0805 T/R; Capacitance: 100nF; Material: Ceramic; Max Operating Temperature: 125°C; Tolerance: 10%; Case/Package: 0805; NexarPartId: 107850848; Height: 1.45mm; Min Operating Temperature: -55°C; Voltage Rating: 250V
C14 = CMP-2007-04663-1: Part Number: 0805YD105MAT2A; Manufacturer: AVX Interconnect / Elco
C16 C17 = CMP-1036-01049-2: Part Number: 08051A150FAT2A; Manufacturer: AVX Interconnect / Elco
D3-D6 = MBR120VLSFT1G: Guardring for Stress Protection; Optimized for Very Low Forward Voltage; 125 C Operating Junction Temperature; Epoxy Meets UL94, VO; Package Designed for Optimal Automated Board Assembly; ESD Rated Machine Model C; ESD Rated Human Body Model 3B; Device Meets MSL 1 Requirements; Pb-Free Packages are Available; Manufacturer_Name: onsemi; Geometry.Height: 0.98mm; Mouser Part Number: 863-MBR120VLSFT1G; Mouser Price/Stock: https://www.mouser.co.uk/ProductDetail/onsemi/MBR120VLSFT1G?qs=3JMERSakebpX%252BkItPpFCkg%3D%3D; Manufacturer_Part_Number: MBR120VLSFT1G; Datasheet Link: https://www.onsemi.com/pub/Collateral/MBR120VLSFT1-D.PDF
FB1 = CMP-08257-000202-1: Power line Ferrite Bead 330Ω @ 100MHz 1.7A DCR 0.08Ω SMD 0603; Impedance: 330R; DC Resistance (DCR): 80mR; Tolerance: 25%; Mount: Surface Mount; Current Rating: 1.7A; Case Code (Metric): 1608; REACH SVHC: No SVHC; Package Quantity: 1; Core Material: Ferrite; Lead Free: Lead Free; Case Code (Imperial): 0603; Max DC Current: 1.7A; Length: 0.063inch; Height: 0.037inch; RoHS Compliant: Yes; Width: 0.031inch; Packaging: Tape and Reel; Case/Package: 0603
J1 = CMP-245163-000001-1: CONN RCPT USB2.0 TYPEC 5A; Manufacturer: GCT; Voltage Rating: 20V; Is Female: yes; Current Rating: 5/6.25/1.25/0.25A; Number Of Contacts: 16; Conn Orientation: Right Angle; Device Class L1: Connectors; Category: Conn; Lead Free: Yes; RoHS: TRUE; Temperature Range High: +85°C; Digikey Description: CONN RCPT USB2.0 TYPEC 5A; Device Class L3: unset; ComponentLink2Description: Datasheet; Manufacturer Part Number: USB4105-GF-A; Package: 0; Usb Standard: USB 2.0; Device Class L2: USB Connectors; Automotive: No; Temperature Range Low: -40°C; Height: 3.46mm; Temperature: -40°C to +85°C; Contact Material: Gold,Nickel; ComponentLink2URL: https://gct.co/files/drawings/usb4105.pdf; Octopart: https://octopart.com/usb4105-gf-a-gct-106627878
J2 = CMP-1024-00100-1: Modified .025" SQ Post Header, Through-hole, Right Angle, -55 to 125 degC, 2.54 mm Pitch, 3-Pin, Male, RoHS; Manufacturer: Samtec; PartNumber: MTSW-103-08-G-S-229-RA; Pitch: 2.54 mm; ComponentLink1URL: http://www.samtec.com; ComponentLink3Description: Package Specification; Mounting Technology: Through-hole; PackageDescription: Assembly .025" [.64] SQ Post Terminal Strip; ComponentLink2URL: http://www.samtec.com/documents/webfiles/pdf/MTSW.PDF; PackageVersion: BI, 2/1987; ComponentLink1Description: Manufacturer URL; PackageReference: MTSW-103-08-X-S-229-RA; Orientation: Right Angle; DatasheetVersion: F-214; RoHS: True; Temperature Range: -55 to 125 degC; ComponentLink3URL: http://www.samtec.com/documents/webfiles/cpdf/MTSW-XXX-XX-X-X-XXXX-XX-XXX-MKT1.pdf; ComponentLink2Description: Datasheet
J3 = CMP-02766-001396-1: CONN RCPT 3POS 0.1 TIN PCB; Pitch: 2.54mm; Connector Type: Receptacle; Max Current Rating: 7.6A; Max Voltage Rating (AC): 550V; Gender: Female; Number of Positions: 3; Contact Resistance: 10mR; Length: 8.13mm; Color: Black; Packaging: Bulk; Height: 8.51mm; RoHS Compliant: Yes; Min Operating Temperature: -55°C; Contact Type: Female Socket; Number of Rows: 1; Series: SSQ; Housing Color: Black; Lead Free: Lead Free; Mount: Through Hole; Housing Material: Plastic; Contact Material: Bronze; Contact Plating: Tin; Orientation: Straight; Termination: Solder; Max Operating Temperature: 105°C; Width: 2.41mm; Radiation Hardening: No; Number of Contacts: 3
R14#1 R15#1 R16#1 R17#1 R18-R20 = RES_0805: Resistor SMD 0805; Manufacturer: *; Manufacturer Part Number: *; Distributor Link: *; LCSC: *
SW1 SW2 = CMP-03407-000026-1: SWITCH TACTILE SPST-NO 0.05A 24V; RoHS Compliant: Yes
TP23#1 TP24-TP29 = TEST_POINT_RND_1MM: Test Point Round 1mm (NO BOM)
U1#1 = CMP-1679-00010-1: Low-Dropout Positive Fixed Voltage Regulator, 1 A, 3.3 V Output Voltage, 0 to 125 degC, 4-Pin SOT-223 (318H-01), Pb-Free, Tape and Reel; Resistance: 220 kohm; Type (Resistor): Thick Film; Voltage Rating: 75 V; Tolerance: 1%; Case\Package: 0603; Power Rating: 100 mW; Width: 0.85 mm; Weight: 7.1E-05 oz; ComponentLink2URL: http://www.onsemi.com/pub_link/Collateral/NCP1117-D.PDF; RoHSCompliant: true; Height: 0.45 mm; PackageDescription: 4-Pin Small Outline Transistor, Body 6.5 x 3.5 mm, Pitch 2.3 mm; ComponentLink1Description: Manufacturer URL; ComponentLink1URL: http://www.onsemi.com/; PackageReference: SOT-223-4-318H-01_A; Max Operating Temperature: 155 degC; Packaging: Tape and Reel; REACH SVHC: Unknown; Length: 1.55 mm; Package Quantity: 5000; Radiation Hardening: No; Min Operating Temperature: -55 degC; DatasheetVersion: Rev. 27, 09/2014; Mount: Surface Mount; Case Code (Imperial): 0603; Case Code (Metric): 1608; ComponentLink2Description: Datasheet
U2#1 = CMP-78876-000011-1: IC FLASH 16MBIT SPI/QUAD 8USON; RoHS Compliant: Yes
U3#1 = RP2040: 32-Bit Dual-Core ARM Cortex-M0+ Microcontroller; Manufacturer: Raspberry Pi; Manufacturer Part Number: RP2040
X1 = ABM8-272-T3: Crystal, 12 MHz, SMD, 3.2mm x 2.5mm, 30 ppm, 10 pF, 30 ppm, ABM8 Series; Manufacturer_Name: ABRACON; Geometry.Height: 0.8mm; Mouser Part Number: 815-ABM8-272-T3; Mouser Price/Stock: https://www.mouser.co.uk/ProductDetail/ABRACON/ABM8-272-T3?qs=QpmGXVUTftEj6miOiJBMxQ%3D%3D; Manufacturer_Part_Number: ABM8-272-T3; Datasheet Link: https://abracon.com/datasheets/ABM8-272-T3.pdf

## Sheet SI5351.V03.R00.SchDoc: Reloj SI5351
size A4; SheetNumber: 9; SheetTotal: 18
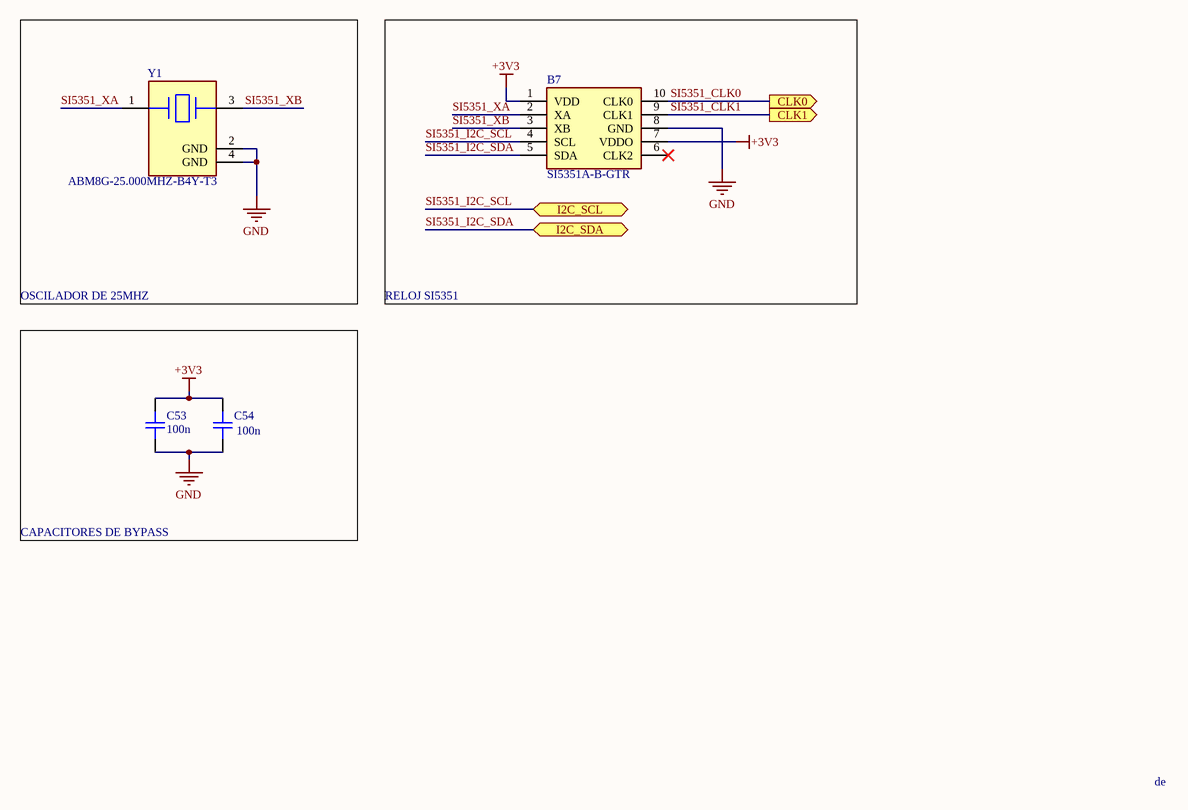
[diagram p2: SI5351.V03.R00.SchDoc]

### Parts
(Parts that share a designator on the sheet are numbered #1, #2 ... from top to bottom, then left to right.)
B7  SI5351A-B-GTR  [SOP50P490X110-10N]
C53#1  100n  [CAP_0805]
C54#1  100n  [CAP_0805]
Y1  ABM8G-25.000MHZ-B4Y-T3  [FP-ABM8G-MFG]

### Blocks framed on the sheet
OSCILADOR DE 25MHZ: Y1
RELOJ SI5351: B7
CAPACITORES DE BYPASS: C53#1 C54#1

### Ports
CLK0 (out), CLK1 (out), I2C_SCL (bidir), I2C_SDA (bidir)

### Nets
+3V3: B7.1(VDD) B7.7(VDDO) C53#1.2 C54#1.2
GND: B7.8(GND) C53#1.1 C54#1.1 Y1.2(GND) Y1.4(GND)
SI5351_CLK0: B7.10(CLK0) ; port CLK0
SI5351_CLK1: B7.9(CLK1) ; port CLK1
SI5351_I2C_SCL: B7.4(SCL) ; port I2C_SCL  [project net I2C_SCL]
SI5351_I2C_SDA: B7.5(SDA) ; port I2C_SDA  [project net I2C_SDA]
SI5351_XA: B7.2(XA) Y1.1
SI5351_XB: B7.3(XB) Y1.3

Not connected (* = marked no-connect by the designer): B7 6(CLK2)*

### Notes on the sheet
- de

### Library data of the parts
B7 = SI5351A-B-GTR: Clock Generator 10MHz to 100MHz-IN 160MHz-OUT 10-Pin MSOP T/R; Manufacturer_Name: Skyworks; Geometry.Height: 1.1mm; Mouser Part Number: 634-SI5351A-B-GTR; Mouser Price/Stock: https://www.mouser.co.uk/ProductDetail/Skyworks-Solutions-Inc/SI5351A-B-GTR?qs=p9T7GgSe1IEYql%252BRMAlVcw%3D%3D; Manufacturer_Part_Number: SI5351A-B-GTR; Datasheet Link: https://www.mouser.de/datasheet/2/472/Si5351_B-2507774.pdf
C53#1 C54#1 = CAP_0805: Capacitor SMD 0805; Manufacturer: *; Manufacturer Part Number: *; Distributor Link: *; LCSC: *; Rating: *; Dielectric: *
Y1 = CMP-27762-015306-1: Crystal 25MHz ±30ppm (Tol) ±30ppm (Stability) 10pF FUND 60Ω 4-Pin SMD T/R; ESR (Equivalent Series Resistance): 60R; Max Operating Temperature: 70°C; Packaging: Tape and Reel; Length: 0.126inch; Height: 0.039inch; Frequency Stability: 30ppm; Package Quantity: 3000; Width: 2.5mm; Number of Pins: 4; Case/Package: SMD/SMT; Mount: Surface Mount; Series: ABM8G; Load Capacitance: 10pF; Min Operating Temperature: -20°C; Termination: SMD/SMT; Frequency: 25MHz; Tolerance: 30ppm; Frequency Tolerance: 30ppm

## Sheet Canal-DDS.V03.R00.SchDoc: Generador de Señal Canal X
size A4; SheetNumber: 3; SheetTotal: 18
Used 2 times, as channels DDS_CANAL1, DDS_CANAL2. Parts and nets are listed once, with the designators drawn on the sheet.
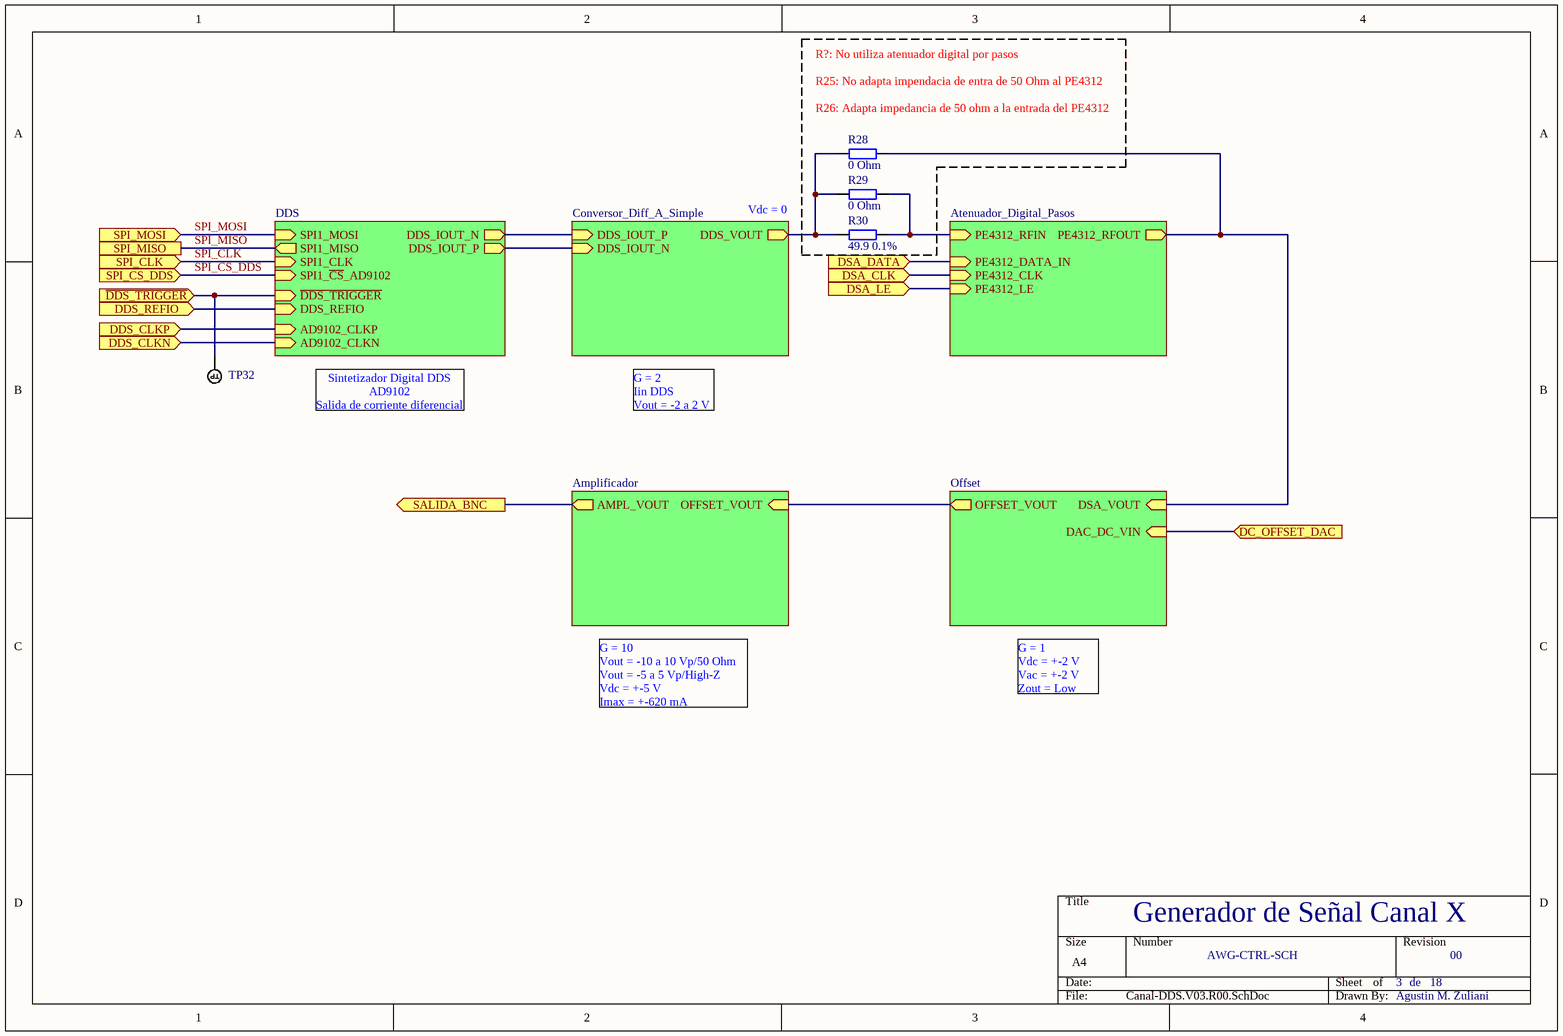
[diagram p3: Canal-DDS.V03.R00.SchDoc]

### Parts
R28  0 Ohm  [RES_0805]
R29  0 Ohm  [RES_0805]
R30  49.9 0.1%  [RES_0805]
TP32  TP_NOBOM  [PAD_RND_1MM]  (value not drawn)  (no BOM)

### Sub-sheets
Amplificador = Amplificador.V03.R00.SchDoc: OFFSET_VOUT (in), AMPL_VOUT (out)
Atenuador_Digital_Pasos = PE4312.V03.R00.SchDoc: PE4312_DATA_IN (in), PE4312_RFIN (in), PE4312_CLK (in), PE4312_LE (in), PE4312_RFOUT (out)
Conversor_Diff_A_Simple = DifferentialToSingleOutput.V03.R00.SchDoc: DDS_IOUT_P (in), DDS_IOUT_N (in), DDS_VOUT (out)
DDS = Sintetizador-AD9102.V03.R00.SchDoc: SPI1_CLK (in), SPI1_MOSI (in), SPI1_MISO (out), SPI1_~{CS}_AD9102 (in), DDS_IOUT_N (out), DDS_IOUT_P (out), AD9102_CLKP (in), AD9102_CLKN (in), ~{DDS_TRIGGER} (in), DDS_REFIO (in)
Offset = Offset.V03.R00.SchDoc: OFFSET_VOUT (out), DAC_DC_VIN (in), DSA_VOUT (in)

### Ports
DC_OFFSET_DAC (in), DDS_CLKN (in), DDS_CLKP (in), DDS_REFIO (in), DSA_CLK (in), DSA_DATA (in), DSA_LE (in), SALIDA_BNC (out), SPI_CLK (in), SPI_CS_DDS (in), SPI_MISO, SPI_MOSI (in), ~{DDS_TRIGGER} (in)

### Nets
~{DDS_TRIGGER}: TP32.1(TP) ; port ~{DDS_TRIGGER}, sheet DDS/~{DDS_TRIGGER}
DC_OFFSET_DAC: port DC_OFFSET_DAC, sheet Offset/DAC_DC_VIN
DDS_CLKN: port DDS_CLKN, sheet DDS/AD9102_CLKN
DDS_CLKP: port DDS_CLKP, sheet DDS/AD9102_CLKP
DDS_REFIO: port DDS_REFIO, sheet DDS/DDS_REFIO
DSA_CLK: port DSA_CLK, sheet Atenuador_Digital_Pasos/PE4312_CLK
DSA_DATA: port DSA_DATA, sheet Atenuador_Digital_Pasos/PE4312_DATA_IN
DSA_LE: port DSA_LE, sheet Atenuador_Digital_Pasos/PE4312_LE
SALIDA_BNC: port SALIDA_BNC, sheet Amplificador/AMPL_VOUT
SPI_CLK: port SPI_CLK, sheet DDS/SPI1_CLK
SPI_CS_DDS: port SPI_CS_DDS, sheet DDS/SPI1_~{CS}_AD9102
SPI_MISO: port SPI_MISO, sheet DDS/SPI1_MISO
SPI_MOSI: port SPI_MOSI, sheet DDS/SPI1_MOSI
NetR28_1: R28.1 R29.1 R30.1 ; sheet Conversor_Diff_A_Simple/DDS_VOUT
NetR28_2: R28.2 ; sheet Atenuador_Digital_Pasos/PE4312_RFOUT, sheet Offset/DSA_VOUT
NetR29_2: R29.2 R30.2 ; sheet Atenuador_Digital_Pasos/PE4312_RFIN
(unnamed): sheet DDS/DDS_IOUT_N, sheet Conversor_Diff_A_Simple/DDS_IOUT_P
(unnamed): sheet DDS/DDS_IOUT_P, sheet Conversor_Diff_A_Simple/DDS_IOUT_N
(unnamed): sheet Offset/OFFSET_VOUT, sheet Amplificador/OFFSET_VOUT

### Channels
DDS_CANAL1: designators R28=R22 R29=R23 R30=R24 TP32=TP22#2; ports DC_OFFSET_DAC=DAC_DC_VIN DDS_CLKN=AD9102_CLK_N DDS_CLKP=AD9102_CLK_P DDS_REFIO=DDS_REFIO_CH1 DSA_CLK=DSA_CLK DSA_DATA=DSA_DATA DSA_LE=DSA_LE_1 SALIDA_BNC=AMPL_VOUT SPI_CLK=SPI_CLK SPI_CS_DDS=MCU_GPIO5 SPI_MISO=SPI_MISO SPI_MOSI=SPI_MOSI ~{DDS_TRIGGER}=MCU_GPIO24
DDS_CANAL2: designators R28=R25 R29=R26 R30=R27 TP32=TP23#2; ports DC_OFFSET_DAC=DAC_DC_VIN DDS_CLKN=AD9102_CLK_N DDS_CLKP=AD9102_CLK_P DDS_REFIO=DDS_REFIO_CH2 DSA_CLK=DSA_CLK DSA_DATA=DSA_DATA DSA_LE=DSA_LE_2 SALIDA_BNC=AMPL_VOUT SPI_CLK=SPI_CLK SPI_CS_DDS=MCU_GPIO9 SPI_MISO=SPI_MISO SPI_MOSI=SPI_MOSI ~{DDS_TRIGGER}=NetB17_32

### Notes on the sheet
- (near R28) R?: No utiliza atenuador digital por pasos
  R25: No adapta impendacia de entra de 50 Ohm al PE4312
  R26: Adapta impedancia de 50 ohm a la entrada del PE4312
- Vdc = 0
- Sintetizador Digital DDS AD9102
  Salida de corriente diferencial
- G = 2
  Iin DDS
  Vout = -2 a 2 V
- G = 10
  Vout = -10 a 10 Vp/50 Ohm
  Vout = -5 a 5 Vp/High-Z
  Vdc = +-5 V
  Imax = +-620 mA
- G = 1
  Vdc = +-2 V
  Vac = +-2 V
  Zout = Low
- de

### Library data of the parts
R28-R30 = RES_0805: Resistor SMD 0805; Manufacturer: *; Manufacturer Part Number: *; Distributor Link: *; LCSC: *
TP32 = TEST_POINT_RND_1MM: Test Point Round 1mm (NO BOM)

## Sheet Sintetizador-AD9102.V03.R00.SchDoc: Sintetizador Digital D. Canal X
size A4; SheetNumber: 4; SheetTotal: 18
Used 2 times, as channels DDS_CANAL1/DDS, DDS_CANAL2/DDS. Parts and nets are listed once, with the designators drawn on the sheet.
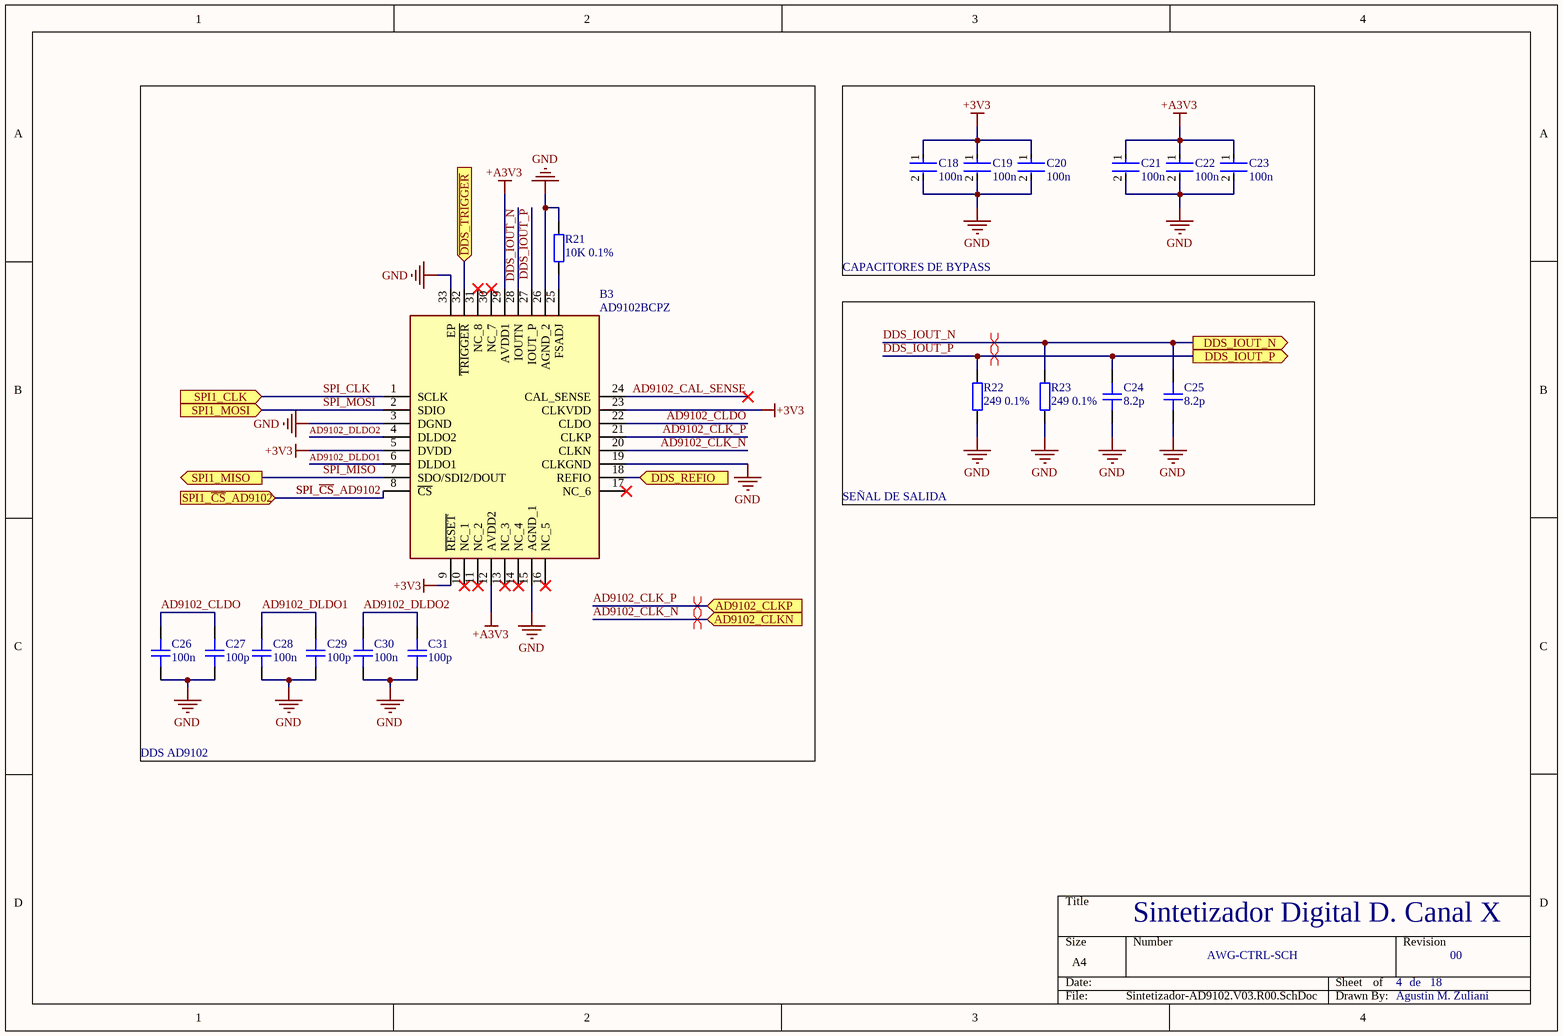
[diagram p4: Sintetizador-AD9102.V03.R00.SchDoc]

### Parts
B3  AD9102BCPZ  [QFN50P500X500X80-33N-D]
C18  100n  [FP-CC0805-EB-MFG]
C19  100n  [FP-CC0805-EB-MFG]
C20  100n  [FP-CC0805-EB-MFG]
C21  100n  [FP-CC0805-EB-MFG]
C22  100n  [FP-CC0805-EB-MFG]
C23  100n  [FP-CC0805-EB-MFG]
C24  8.2p  [CAP_0805]
C25  8.2p  [CAP_0805]
C26  100n  [CAP_0805]
C27  100p  [CAP_0805]
C28  100n  [CAP_0805]
C29  100p  [CAP_0805]
C30  100n  [CAP_0805]
C31  100p  [CAP_0805]
R21  10K 0.1%  [RES_0805]
R22  249 0.1%  [RES_0805]
R23  249 0.1%  [RES_0805]

### Blocks framed on the sheet
DDS AD9102: B3 C26-C31 R21
CAPACITORES DE BYPASS: C18-C23
SEÑAL DE SALIDA: C24 C25 R22 R23

### Ports
AD9102_CLKN (in), AD9102_CLKP (in), DDS_IOUT_N (out), DDS_IOUT_P (out), DDS_REFIO (in), SPI1_CLK (in), SPI1_MISO (out), SPI1_MOSI (in), SPI1_~{CS}_AD9102 (in), ~{DDS_TRIGGER} (in)

### Nets
+3V3: B3.5(DVDD) B3.9(~{RESET}) B3.23(CLKVDD) C18.1 C19.1 C20.1
+A3V3: B3.12(AVDD2) B3.29(AVDD1) C21.1 C22.1 C23.1
GND: B3.3(DGND) B3.15(AGND_1) B3.19(CLKGND) B3.26(AGND_2) B3.33(EP) C18.2 C19.2 C20.2 C21.2 C22.2 C23.2 C24.2 C25.2 C26.1 C27.1 C28.1 C29.1 C30.1 C31.1 R21.2 R22.1 R23.1
~{DDS_TRIGGER}: B3.32(~{TRIGGER}) ; port ~{DDS_TRIGGER}
AD9102_CAL_SENSE: B3.24(CAL_SENSE)
AD9102_CLDO: B3.22(CLDO) C26.2 C27.2
AD9102_CLK_N: B3.20(CLKN) ; port AD9102_CLKN
AD9102_CLK_P: B3.21(CLKP) ; port AD9102_CLKP
AD9102_DLDO1: B3.6(DLDO1) C28.2 C29.2
AD9102_DLDO2: B3.4(DLDO2) C30.2 C31.2
DDS_IOUT_N: B3.28(IOUTN) C25.1 R23.2 ; port DDS_IOUT_N
DDS_IOUT_P: B3.27(IOUT_P) C24.1 R22.2 ; port DDS_IOUT_P
DDS_REFIO: B3.18(REFIO) ; port DDS_REFIO
SPI_~{CS}: B3.8(~{CS}) ; port SPI1_~{CS}_AD9102  [also labelled SPI_~{CS}_AD9102]
SPI_CLK: B3.1(SCLK) ; port SPI1_CLK
SPI_MISO: B3.7(SDO/SDI2/DOUT) ; port SPI1_MISO
SPI_MOSI: B3.2(SDIO) ; port SPI1_MOSI
NetB3_25: B3.25(FSADJ) R21.1

Not connected (* = marked no-connect by the designer): B3 10(NC_1)* 11(NC_2)* 13(NC_3)* 14(NC_4)* 16(NC_5)* 17(NC_6)* 30(NC_7)* 31(NC_8)*

### Channels
DDS_CANAL1/DDS: designators B3=B16 C18=C139#1 C19=C140#1 C20=C141#1 C21=C142#1 C22=C143#1 C23=C144#1 C24=C145#1 C25=C146 C26=C147 C27=C148 C28=C149 C29=C150 C30=C151 C31=C152 R21=R108#1 R22=R109#1 R23=R110#1; ports AD9102_CLKN=AD9102_CLK_N AD9102_CLKP=AD9102_CLK_P DDS_IOUT_N=DDS_IOUT_N DDS_IOUT_P=DDS_IOUT_P DDS_REFIO=DDS_REFIO_CH1 SPI1_CLK=SPI_CLK SPI1_MISO=SPI_MISO SPI1_MOSI=SPI_MOSI SPI1_~{CS}_AD9102=MCU_GPIO5 ~{DDS_TRIGGER}=MCU_GPIO24
DDS_CANAL2/DDS: designators B3=B17 C18=C153 C19=C154 C20=C155 C21=C156 C22=C157 C23=C158 C24=C159 C25=C160 C26=C161 C27=C162 C28=C163 C29=C164 C30=C165 C31=C166 R21=R111#1 R22=R112#1 R23=R113#1; ports AD9102_CLKN=AD9102_CLK_N AD9102_CLKP=AD9102_CLK_P DDS_IOUT_N=DDS_IOUT_N DDS_IOUT_P=DDS_IOUT_P DDS_REFIO=DDS_REFIO_CH2 SPI1_CLK=SPI_CLK SPI1_MISO=SPI_MISO SPI1_MOSI=SPI_MOSI SPI1_~{CS}_AD9102=MCU_GPIO9 ~{DDS_TRIGGER}=NetB17_32

### Layout directives
differential pair: AD9102_CLK_N, AD9102_CLK_P, DDS_IOUT_N, DDS_IOUT_P

### Notes on the sheet
- de

### Library data of the parts
B3 = AD9102BCPZ: Analog Devices AD9102BCPZ, 14 bit Serial DAC, 180Msps, 32-Pin LFCSP; Geometry.Height: 0.8mm; Mouser Part Number: 584-AD9102BCPZ; Mouser Price/Stock: https://www.mouser.co.uk/ProductDetail/Analog-Devices/AD9102BCPZ?qs=%2FtpEQrCGXCx4RM%2FcE0d16g%3D%3D; Manufacturer_Name: Analog Devices; Manufacturer_Part_Number: AD9102BCPZ; Datasheet Link: https://www.analog.com/media/en/technical-documentation/data-sheets/AD9102.pdf
C18-C23 = CMP-00621-107850848-1: as C5 on sheet Microcontrolador.V03.R00; Material: Ceramic; Max Operating Temperature: 125°C; Tolerance: 10%; Case/Package: 0805; NexarPartId: 107850848; Height: 1.45mm; Min Operating Temperature: -55°C; Voltage Rating: 250V
C24-C31 = CAP_0805: Capacitor SMD 0805; Manufacturer: *; Manufacturer Part Number: *; Distributor Link: *; LCSC: *; Rating: *; Dielectric: *
R21-R23 = RES_0805: Resistor SMD 0805; Manufacturer: *; Manufacturer Part Number: *; Distributor Link: *; LCSC: *

## Sheet DifferentialToSingleOutput.V03.R00.SchDoc: Señal Diferencial a Simple
size A4; SheetNumber: 5; SheetTotal: 18
Used 2 times, as channels DDS_CANAL1/Conversor_Diff_A_Simple, DDS_CANAL2/Conversor_Diff_A_Simple. Parts and nets are listed once, with the designators drawn on the sheet.
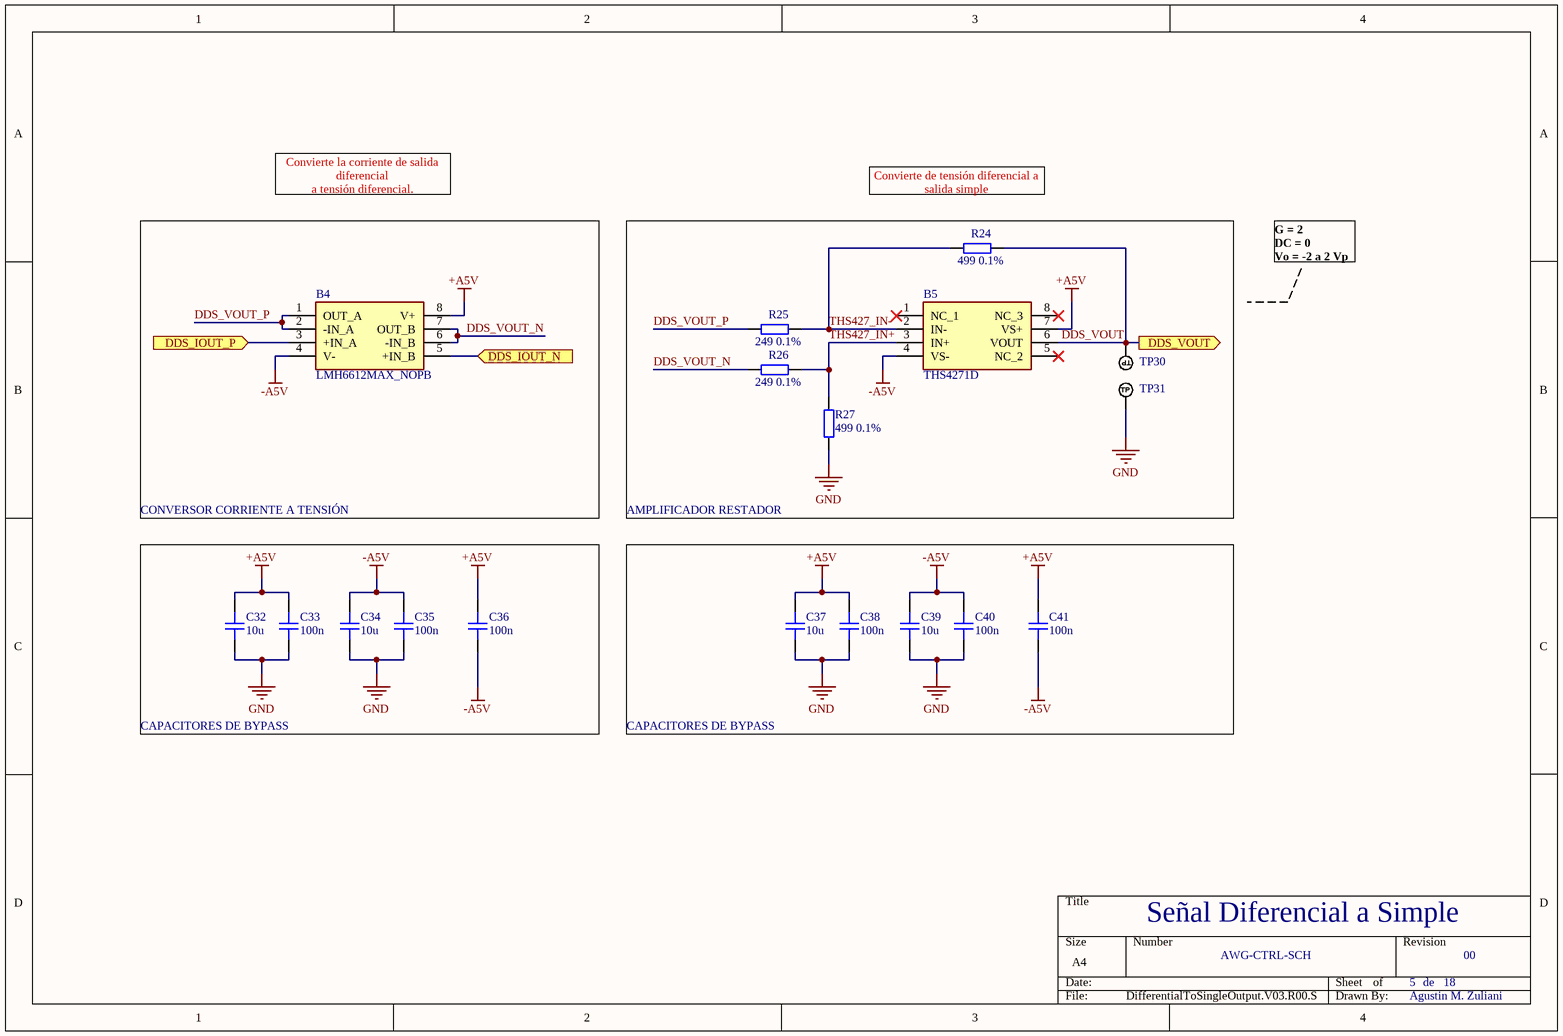
[diagram p5: DifferentialToSingleOutput.V03.R00.SchDoc]

### Parts
B4  LMH6612MAX_NOPB  [SOIC127P600X175-8N]
B5  THS4271D  [SOIC127P600X175-8N]
C32  10u  [CAP_0805]
C33  100n  [CAP_0805]
C34  10u  [CAP_0805]
C35  100n  [CAP_0805]
C36  100n  [CAP_0805]
C37  10u  [CAP_0805]
C38  100n  [CAP_0805]
C39  10u  [CAP_0805]
C40  100n  [CAP_0805]
C41  100n  [CAP_0805]
R24  499 0.1%  [RES_0805]
R25  249 0.1%  [RES_0805]
R26  249 0.1%  [RES_0805]
R27  499 0.1%  [RES_0805]
TP30  TP_NOBOM  [PAD_RND_1MM]  (value not drawn)  (no BOM)
TP31  TP_NOBOM  [PAD_RND_1MM]  (value not drawn)  (no BOM)

### Blocks framed on the sheet
CONVERSOR CORRIENTE A TENSIÓN: B4
AMPLIFICADOR RESTADOR: B5 R24-R27 TP30 TP31
CAPACITORES DE BYPASS: C32-C36
CAPACITORES DE BYPASS: C37-C41

### Ports
DDS_IOUT_N (in), DDS_IOUT_P (in), DDS_VOUT (out)

### Nets
+A5V: B4.8(V+) B5.7(VS+) C32.2 C33.2 C36.2 C37.2 C38.2 C41.2
-A5V: B4.4(V-) B5.4(VS-) C34.2 C35.2 C36.1 C39.2 C40.2 C41.1
GND: C32.1 C33.1 C34.1 C35.1 C37.1 C38.1 C39.1 C40.1 R27.1 TP31.1(TP)
DDS_IOUT_N: B4.5(+IN_B) ; port DDS_IOUT_N
DDS_IOUT_P: B4.3(+IN_A) ; port DDS_IOUT_P
DDS_VOUT: B5.6(VOUT) R24.2 TP30.1(TP) ; port DDS_VOUT
DDS_VOUT_N: B4.6(-IN_B) B4.7(OUT_B) R26.1
DDS_VOUT_P: B4.1(OUT_A) B4.2(-IN_A) R25.1
THS427_IN+: B5.3(IN+) R26.2 R27.2
THS427_IN-: B5.2(IN-) R24.1 R25.2

Not connected (* = marked no-connect by the designer): B5 1(NC_1)* 5(NC_2)* 8(NC_3)*

### Channels
DDS_CANAL1/Conversor_Diff_A_Simple: designators B4=B2#2 B5=B3 C32=C46 C33=C47 C34=C48 C35=C49 C36=C50 C37=C51 C38=C52 C39=C53#2 C40=C54#2 C41=C55#1 R24=R51 R25=R52#1 R26=R53#1 R27=R54#1 TP30=TP46 TP31=TP47; ports DDS_IOUT_N=DDS_IOUT_P DDS_IOUT_P=DDS_IOUT_N DDS_VOUT=DDS_VOUT
DDS_CANAL2/Conversor_Diff_A_Simple: designators B4=B4 B5=B5 C32=C56#2 C33=C57#2 C34=C58#2 C35=C59#2 C36=C60#2 C37=C61 C38=C62 C39=C63#2 C40=C64#2 C41=C65#2 R24=R55#2 R25=R56#2 R26=R57#2 R27=R58#2 TP30=TP48 TP31=TP49; ports DDS_IOUT_N=DDS_IOUT_P DDS_IOUT_P=DDS_IOUT_N DDS_VOUT=DDS_VOUT

### Notes on the sheet
- Convierte la corriente de salida diferencial
  a tensión diferencial.
- Convierte de tensión diferencial a salida simple
- G = 2
  DC = 0
  Vo = -2 a 2 Vp
- de

### Library data of the parts
B4 = LMH6612MAX_NOPB: Single Supply, Dual 345 MHz Rail-to-Rail Output Amplifier; Manufacturer_Name: Texas Instruments; Manufacturer_Part_Number: LMH6612MAX/NOPB; Geometry.Height: 1.75mm; Mouser Part Number: 926-LMH6612MAX/NOPB; Mouser Price/Stock: https://www.mouser.co.uk/ProductDetail/Texas-Instruments/LMH6612MAX-NOPB?qs=7lkVKPoqpbYkkjxJnAARvQ%3D%3D; Datasheet Link: http://www.ti.com/lit/gpn/LMH6612
B5 = THS4271D: Super-Fast Ultra-Low Distortion High Speed Amplifier; Manufacturer_Name: Texas Instruments; Geometry.Height: 1.75mm; Mouser Part Number: 595-THS4271D; Mouser Price/Stock: https://www.mouser.co.uk/ProductDetail/Texas-Instruments/THS4271D?qs=ZmJdcv7QZ9ppdaigv2fizw%3D%3D; Manufacturer_Part_Number: THS4271D; Datasheet Link: http://www.ti.com/lit/ds/symlink/ths4271.pdf
C32-C41 = CAP_0805: Capacitor SMD 0805; Manufacturer: *; Manufacturer Part Number: *; Distributor Link: *; LCSC: *; Rating: *; Dielectric: *
R24-R27 = RES_0805: Resistor SMD 0805; Manufacturer: *; Manufacturer Part Number: *; Distributor Link: *; LCSC: *
TP30 TP31 = TEST_POINT_RND_1MM: Test Point Round 1mm (NO BOM)

## Sheet PE4312.V03.R00.SchDoc: Atenuador Digital por Pasos
size A4; SheetNumber: 6; SheetTotal: 18
Used 2 times, as channels DDS_CANAL1/Atenuador_Digital_Pasos, DDS_CANAL2/Atenuador_Digital_Pasos. Parts and nets are listed once, with the designators drawn on the sheet.
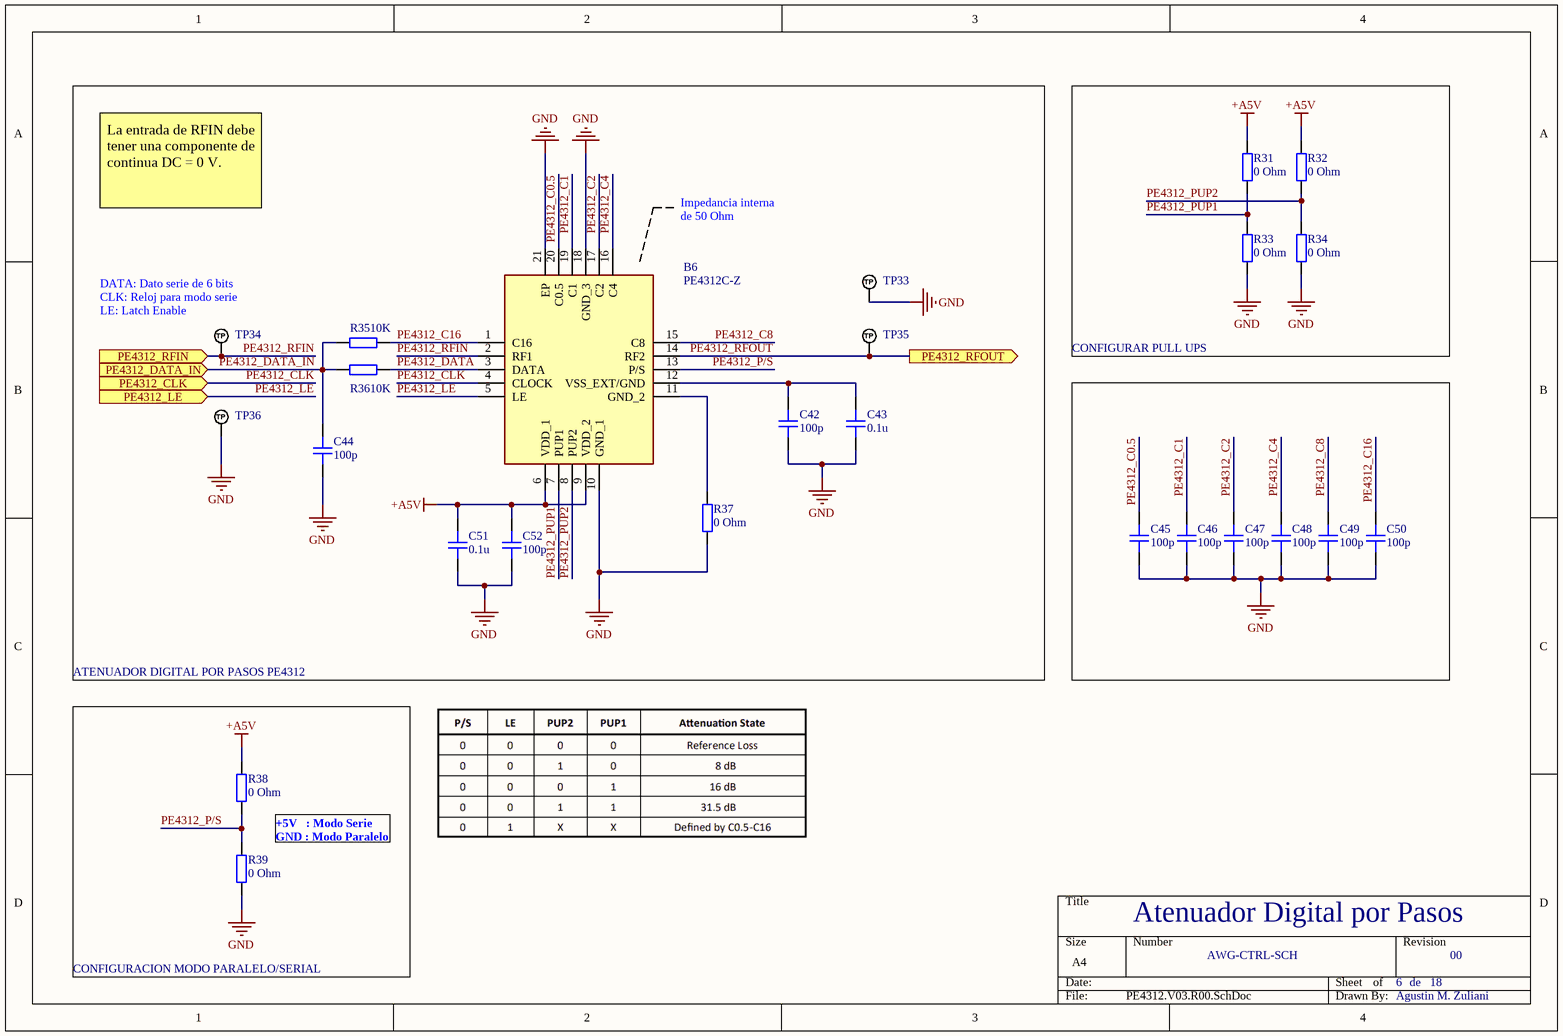
[diagram p6: PE4312.V03.R00.SchDoc]

### Parts
B6  PE4312C-Z  [QFN50P400X400X90-21N-D]
C42  100p  [CAP_0805]
C43  0.1u  [CAP_0805]
C44  100p  [CAP_0805]
C45  100p  [CAP_0805]
C46  100p  [CAP_0805]
C47  100p  [CAP_0805]
C48  100p  [CAP_0805]
C49  100p  [CAP_0805]
C50  100p  [CAP_0805]
C51  0.1u  [CAP_0805]
C52  100p  [CAP_0805]
R31  0 Ohm  [RES_0805]
R32  0 Ohm  [RES_0805]
R33  0 Ohm  [RES_0805]
R34  0 Ohm  [RES_0805]
R35  10K  [RES_0805]
R36  10K  [RES_0805]
R37  0 Ohm  [RES_0805]
R38  0 Ohm  [RES_0805]
R39  0 Ohm  [RES_0805]
TP33  TP_NOBOM  [PAD_RND_1MM]  (value not drawn)  (no BOM)
TP34  TP_NOBOM  [PAD_RND_1MM]  (value not drawn)  (no BOM)
TP35  TP_NOBOM  [PAD_RND_1MM]  (value not drawn)  (no BOM)
TP36  TP_NOBOM  [PAD_RND_1MM]  (value not drawn)  (no BOM)

### Blocks framed on the sheet
ATENUADOR DIGITAL POR PASOS PE4312: B6 C42-C44 C51 C52 R35-R37 TP33-TP36
CONFIGURAR PULL UPS: R31-R34
CONFIGURACION MODO PARALELO/SERIAL: R38 R39

### Ports
PE4312_CLK (in), PE4312_DATA_IN (in), PE4312_LE (in), PE4312_RFIN (in), PE4312_RFOUT (out)

### Nets
+A5V: B6.6(VDD_1) B6.9(VDD_2) C51.2 C52.2 R31.2 R32.2 R38.2
GND: B6.10(GND_1) B6.18(GND_3) B6.21(EP) C42.1 C43.1 C44.1 C45.1 C46.1 C47.1 C48.1 C49.1 C50.1 C51.1 C52.1 R33.1 R34.1 R37.1 R39.1 TP33.1(TP) TP36.1(TP)
PE4312_C0.5: B6.20(C0.5) C45.2
PE4312_C1: B6.19(C1) C46.2
PE4312_C2: B6.17(C2) C47.2
PE4312_C4: B6.16(C4) C48.2
PE4312_C8: B6.15(C8) C49.2
PE4312_C16: B6.1(C16) C50.2 R35.2
PE4312_CLK: B6.4(CLOCK) ; port PE4312_CLK
PE4312_DATA: B6.3(DATA) R36.2
PE4312_DATA_IN: C44.2 R35.1 R36.1 ; port PE4312_DATA_IN
PE4312_LE: B6.5(LE) ; port PE4312_LE
PE4312_P/S: B6.13(P/S) R38.1 R39.2
PE4312_PUP1: B6.7(PUP1) R31.1 R33.2
PE4312_PUP2: B6.8(PUP2) R32.1 R34.2
PE4312_RFIN: B6.2(RF1) TP34.1(TP) ; port PE4312_RFIN
PE4312_RFOUT: B6.14(RF2) TP35.1(TP) ; port PE4312_RFOUT
NetB6_11: B6.11(GND_2) R37.2
NetB6_12: B6.12(VSS_EXT/GND) C42.2 C43.2

### Channels
DDS_CANAL1/Atenuador_Digital_Pasos: designators B6=B13#1 C42=C115#1 C43=C116#1 C44=C117#1 C45=C118#1 C46=C119#1 C47=C120#1 C48=C121#1 C49=C122#1 C50=C123#1 C51=C124#1 C52=C125#1 R31=R90#1 R32=R91#1 R33=R92#1 R34=R93#1 R35=R94#1 R36=R95#1 R37=R96#1 R38=R97#1 R39=R98#1 TP33=TP73 TP34=TP74 TP35=TP75 TP36=TP76; ports PE4312_CLK=DSA_CLK PE4312_DATA_IN=DSA_DATA PE4312_LE=DSA_LE_1 PE4312_RFIN=PE4312_RFIN PE4312_RFOUT=DSA_VOUT
DDS_CANAL2/Atenuador_Digital_Pasos: designators B6=B14 C42=C126#1 C43=C127#1 C44=C128#1 C45=C129#1 C46=C130#1 C47=C131#1 C48=C132#1 C49=C133#1 C50=C134#1 C51=C135#1 C52=C136#1 R31=R99#1 R32=R100#1 R33=R101#1 R34=R102#1 R35=R103#1 R36=R104#1 R37=R105#1 R38=R106#1 R39=R107#1 TP33=TP77 TP34=TP78 TP35=TP79 TP36=TP80; ports PE4312_CLK=DSA_CLK PE4312_DATA_IN=DSA_DATA PE4312_LE=DSA_LE_2 PE4312_RFIN=PE4312_RFIN PE4312_RFOUT=DSA_VOUT

### Notes on the sheet
- La entrada de RFIN debe tener una componente de continua DC = 0 V.
- Impedancia interna de 50 Ohm
- (near TP34) DATA: Dato serie de 6 bits
  CLK: Reloj para modo serie
  LE: Latch Enable
- +5V   : Modo Serie
  GND : Modo Paralelo
- de

### Library data of the parts
B6 = PE4312C-Z: RF ATTENUATOR 31.5DB 50OHM 20QFN; Manufacturer_Name: Peregrine Semiconductor; Geometry.Height: 0.9mm; Mouser Part Number: 81-PE4312C-Z; Mouser Price/Stock: https://www.mouser.co.uk/ProductDetail/pSemi/PE4312C-Z?qs=l7cgNqFNU1hgFbGgRtu7ww%3D%3D; Manufacturer_Part_Number: PE4312C-Z; Datasheet Link: https://www.psemi.com/pdf/datasheets/pe4312ds.pdf
C42-C52 = CAP_0805: Capacitor SMD 0805; Manufacturer: *; Manufacturer Part Number: *; Distributor Link: *; LCSC: *; Rating: *; Dielectric: *
R31-R39 = RES_0805: Resistor SMD 0805; Manufacturer: *; Manufacturer Part Number: *; Distributor Link: *; LCSC: *
TP33-TP36 = TEST_POINT_RND_1MM: Test Point Round 1mm (NO BOM)

## Sheet Offset.V03.R00.SchDoc: Agregado de Offset a Canal X
size A4; SheetNumber: 7; SheetTotal: 18
Used 2 times, as channels DDS_CANAL1/Offset, DDS_CANAL2/Offset. Parts and nets are listed once, with the designators drawn on the sheet.
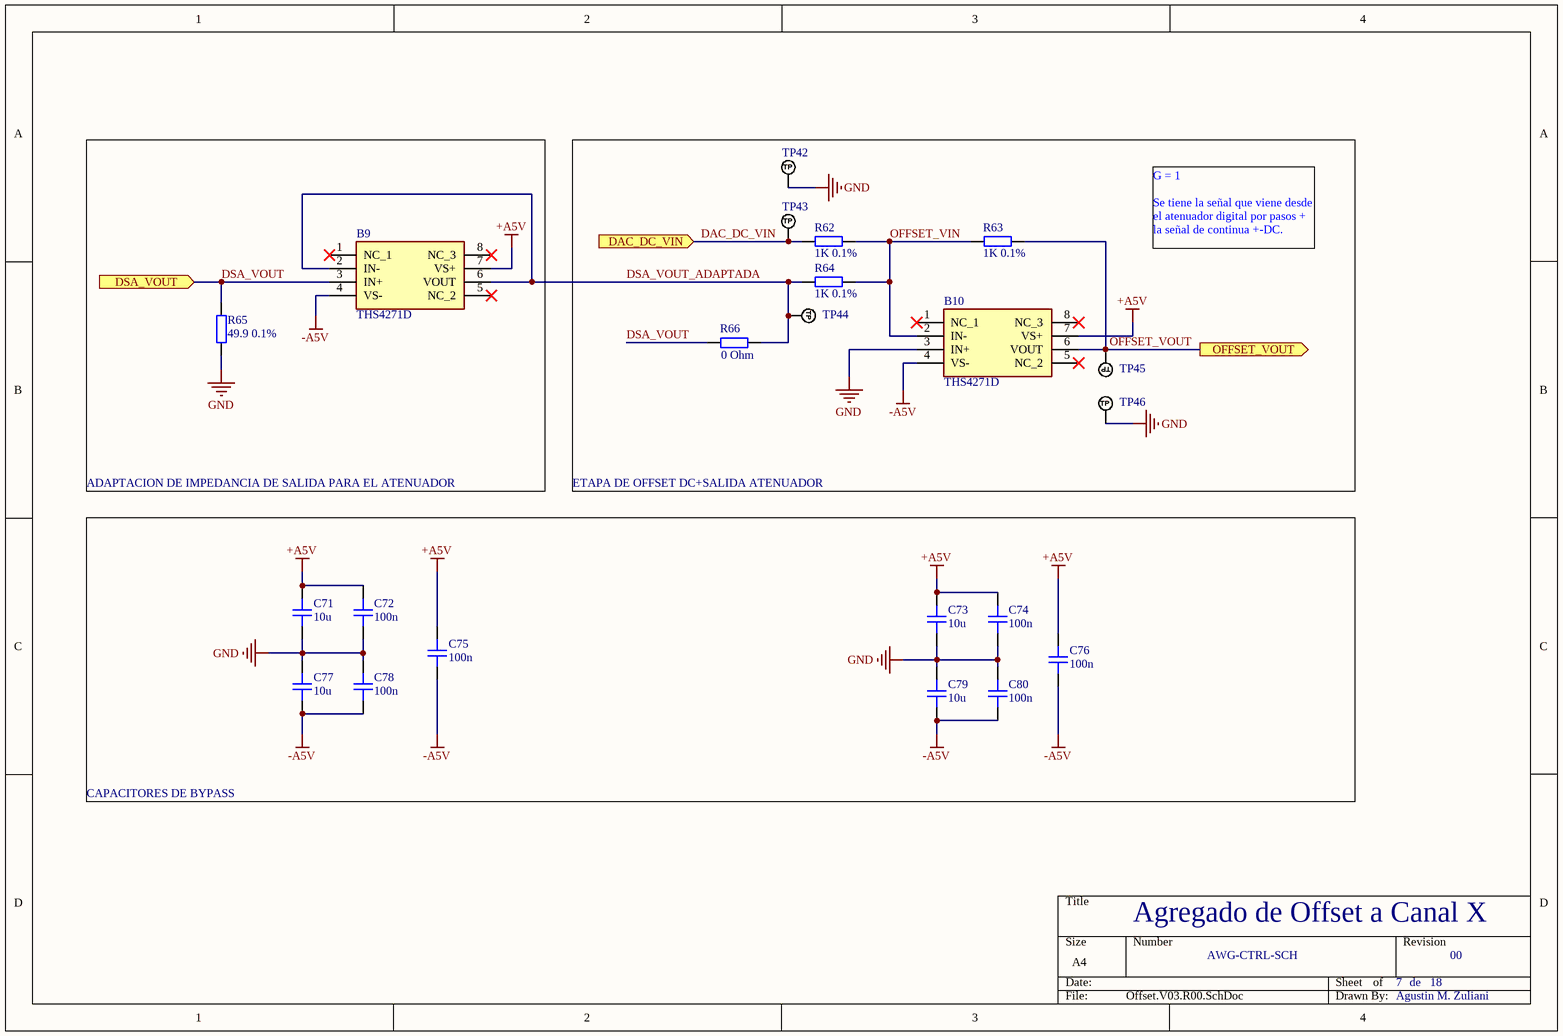
[diagram p7: Offset.V03.R00.SchDoc]

### Parts
B9  THS4271D  [SOIC127P600X175-8N]
B10  THS4271D  [SOIC127P600X175-8N]
C71  10u  [CAP_0805]
C72  100n  [CAP_0805]
C73  10u  [CAP_0805]
C74  100n  [CAP_0805]
C75  100n  [CAP_0805]
C76  100n  [CAP_0805]
C77  10u  [CAP_0805]
C78  100n  [CAP_0805]
C79  10u  [CAP_0805]
C80  100n  [CAP_0805]
R62  1K 0.1%  [RES_0805]
R63  1K 0.1%  [RES_0805]
R64  1K 0.1%  [RES_0805]
R65  49.9 0.1%  [RES_0805]
R66  0 Ohm  [RES_0805]
TP42  TP_NOBOM  [PAD_RND_1MM]  (value not drawn)  (no BOM)
TP43  TP_NOBOM  [PAD_RND_1MM]  (value not drawn)  (no BOM)
TP44  TP_NOBOM  [PAD_RND_1MM]  (value not drawn)  (no BOM)
TP45  TP_NOBOM  [PAD_RND_1MM]  (value not drawn)  (no BOM)
TP46  TP_NOBOM  [PAD_RND_1MM]  (value not drawn)  (no BOM)

### Blocks framed on the sheet
ADAPTACION DE IMPEDANCIA DE SALIDA PARA EL ATENUADOR: B9 R65
ETAPA DE OFFSET DC+SALIDA ATENUADOR: B10 R62-R64 R66 TP42-TP46
CAPACITORES DE BYPASS: C71-C80

### Ports
DAC_DC_VIN (in), DSA_VOUT (in), OFFSET_VOUT (out)

### Nets
+A5V: B9.7(VS+) B10.7(VS+) C71.2 C72.2 C73.2 C74.2 C75.2 C76.2
-A5V: B9.4(VS-) B10.4(VS-) C75.1 C76.1 C77.1 C78.1 C79.1 C80.1
GND: B10.3(IN+) C71.1 C72.1 C73.1 C74.1 C77.2 C78.2 C79.2 C80.2 R65.1 TP42.1(TP) TP46.1(TP)
DAC_DC_VIN: R62.1 TP43.1(TP) ; port DAC_DC_VIN
DSA_VOUT: B9.3(IN+) R65.2 R66.1 ; port DSA_VOUT
DSA_VOUT_ADAPTADA: B9.2(IN-) B9.6(VOUT) R64.1 R66.2 TP44.1(TP)
OFFSET_VIN: B10.2(IN-) R62.2 R63.1 R64.2
OFFSET_VOUT: B10.6(VOUT) R63.2 TP45.1(TP) ; port OFFSET_VOUT

Not connected (* = marked no-connect by the designer): B9 1(NC_1)* 5(NC_2)* 8(NC_3)*; B10 1(NC_1)* 5(NC_2)* 8(NC_3)*

### Channels
DDS_CANAL1/Offset: designators B9=B8#1 B10=B9 C71=C87 C72=C88 C73=C89#1 C74=C90#1 C75=C91#1 C76=C92#1 C77=C93#1 C78=C94#1 C79=C95#1 C80=C96#1 R62=R70 R63=R71 R64=R72 R65=R73#1 R66=R74#1 TP42=TP59#1 TP43=TP60#1 TP44=TP61#1 TP45=TP62#1 TP46=TP63#1; ports DAC_DC_VIN=DAC_DC_VIN DSA_VOUT=DSA_VOUT OFFSET_VOUT=OFFSET_VOUT
DDS_CANAL2/Offset: designators B9=B10 B10=B11#1 C71=C97#1 C72=C98#1 C73=C99#1 C74=C100#1 C75=C101#1 C76=C102#1 C77=C103#1 C78=C104#1 C79=C105#1 C80=C106#1 R62=R75#2 R63=R76#2 R64=R77#1 R65=R78#1 R66=R79#1 TP42=TP64#1 TP43=TP65#1 TP44=TP66#1 TP45=TP67#1 TP46=TP68#2; ports DAC_DC_VIN=DAC_DC_VIN DSA_VOUT=DSA_VOUT OFFSET_VOUT=OFFSET_VOUT

### Notes on the sheet
- G = 1
  Se tiene la señal que viene desde el atenuador digital por pasos + la señal de continua +-DC.
- de

### Library data of the parts
B9 B10 = THS4271D: as B5 on sheet DifferentialToSingleOutput.V03.R00; Mouser Part Number: 595-THS4271D; Mouser Price/Stock: https://www.mouser.co.uk/ProductDetail/Texas-Instruments/THS4271D?qs=ZmJdcv7QZ9ppdaigv2fizw%3D%3D; Manufacturer_Part_Number: THS4271D; Datasheet Link: http://www.ti.com/lit/ds/symlink/ths4271.pdf
C71-C80 = CAP_0805: Capacitor SMD 0805; Manufacturer: *; Manufacturer Part Number: *; Distributor Link: *; LCSC: *; Rating: *; Dielectric: *
R62-R66 = RES_0805: Resistor SMD 0805; Manufacturer: *; Manufacturer Part Number: *; Distributor Link: *; LCSC: *
TP42-TP46 = TEST_POINT_RND_1MM: Test Point Round 1mm (NO BOM)